# EAGLE design ECU_Board_2025 (EAGLE 9.6.2)

## Sheet 1 of 3
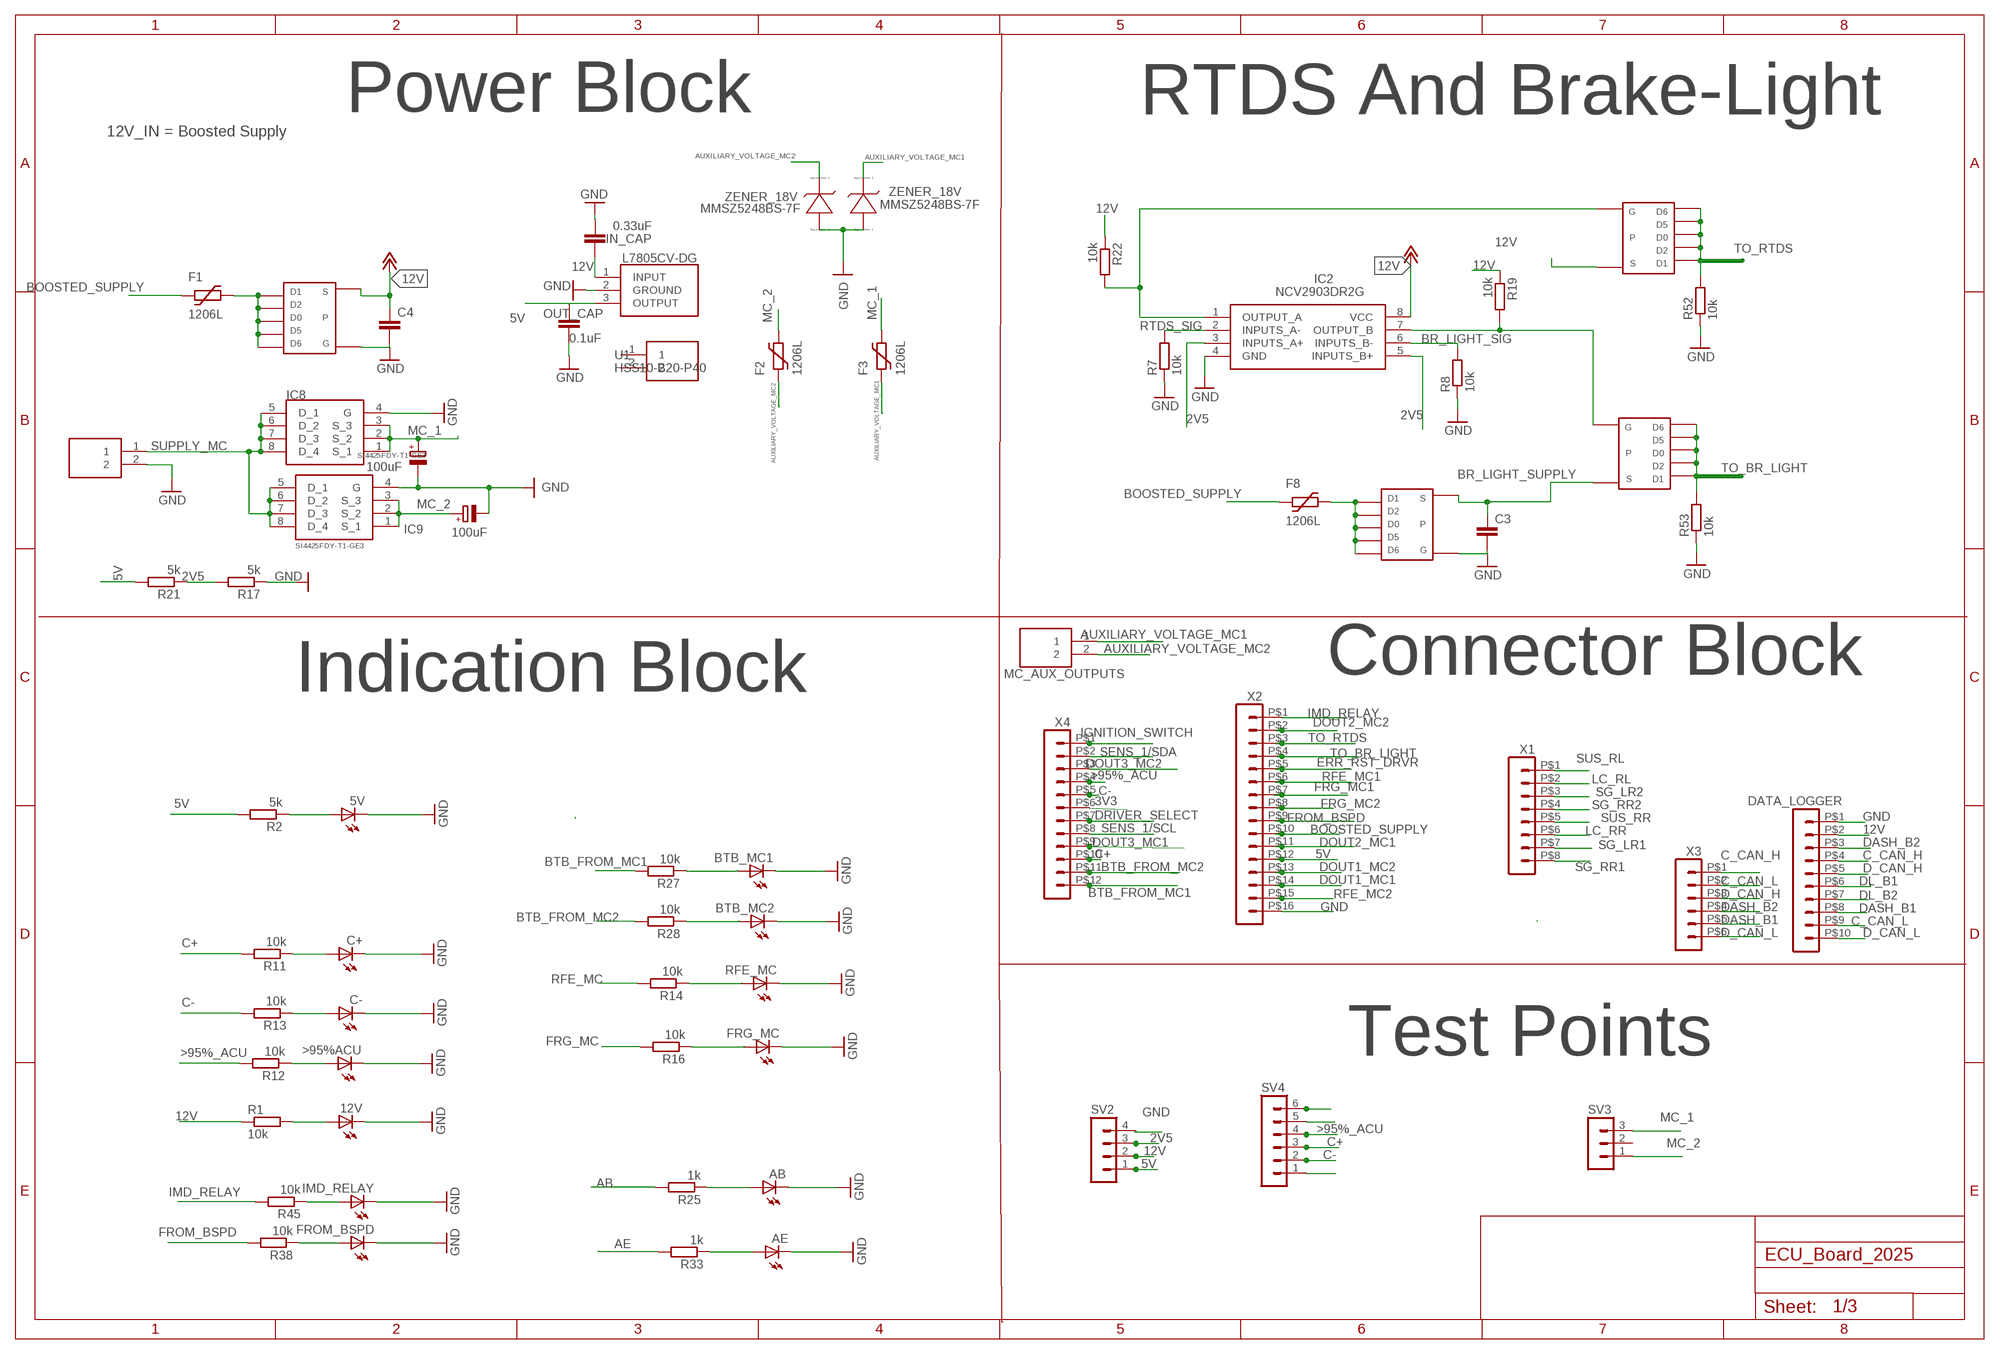
[diagram p0: schematic, sheet 1]

### Parts
5V  LED-FKIT-1206  [FKIT-LED-1206]
12V  LED-FKIT-1206  [FKIT-LED-1206]
>95%ACU  LED-FKIT-1206  [FKIT-LED-1206]
AB  LED-FKIT-1206  [FKIT-LED-1206]
AE  LED-FKIT-1206  [FKIT-LED-1206]
BOOSTED_SUPPLY1  172447-0002  [172447-YY02]
BTB_MC1  LED-FKIT-1206  [FKIT-LED-1206]
BTB_MC2  LED-FKIT-1206  [FKIT-LED-1206]
C3  C-EUC0805  [C0805]
C4  C-EUC0805  [C0805]
C7  100uF  CPOL-EUE2.5-6  [E2,5-6]
C8  100uF  CPOL-EUE2.5-6  [E2,5-6]
C+  LED-FKIT-1206  [FKIT-LED-1206]
C-  LED-FKIT-1206  [FKIT-LED-1206]
D4  ZENER  [SOD123]
D5  ZENER  [SOD123]
DATA_LOGGER  HEADER_POS10_43045-1012  [43045-1012]
F1  1206L  [1206L]
F2  1206L  [1206L]
F3  1206L  [1206L]
F8  1206L  [1206L]
FRG_MC  LED-FKIT-1206  [FKIT-LED-1206]
FROM_BSPD  LED-FKIT-1206  [FKIT-LED-1206]
IC2  NCV2903DR2G  [SOIC127P600X175-8N]
IC4  L7805CV-DG  [TO255P460X1020X2008-3P]
IC8  SI4425FDY-T1-GE3  [SOIC127P600X175-8N]
IC9  SI4425FDY-T1-GE3  [SOIC127P600X175-8N]
IMD_RELAY  LED-FKIT-1206  [FKIT-LED-1206]
IN_CAP  0.33uF  C-EUC0805  [C0805]
MC_AUX_OUTPUTS  172447-0002  [172447-YY02]
OUT_CAP  0.1uF  C-EUC0805  [C0805]
R1  10k  R-EU_R0805  [R0805]
R2  5k  R-EU_R0805  [R0805]
R7  10k  R-EU_R0805  [R0805]
R8  10k  R-EU_R0805  [R0805]
R11  10k  R-EU_R0805  [R0805]
R12  10k  R-EU_R0805  [R0805]
R13  10k  R-EU_R0805  [R0805]
R14  10k  R-EU_R0805  [R0805]
R16  10k  R-EU_R0805  [R0805]
R17  5k  R-EU_R0805  [R0805]
R19  10k  R-EU_R0805  [R0805]
R21  5k  R-EU_R0805  [R0805]
R22  10k  R-EU_R0805  [R0805]
R25  1k  R-EU_R0805  [R0805]
R27  10k  R-EU_R0805  [R0805]
R28  10k  R-EU_R0805  [R0805]
R33  1k  R-EU_R0805  [R0805]
R38  10k  R-EU_R0805  [R0805]
R45  10k  R-EU_R0805  [R0805]
R52  10k  R-EU_R0805  [R0805]
R53  10k  R-EU_R0805  [R0805]
RFE_MC  LED-FKIT-1206  [FKIT-LED-1206]
SV2  MA04-1  [MA04-1]
SV3  MA03-1  [MA03-1]
SV4  MA06-1  [MA06-1]
U1  HSS10-B20-P40  [HSS10B20P40]
U$1  TSOP-6_PMOS  [TSOP-6_PMOS]
U$13  TSOP-6_PMOS  [TSOP-6_PMOS]
U$16  TSOP-6_PMOS  [TSOP-6_PMOS]
U$17  TSOP-6_PMOS  [TSOP-6_PMOS]
X1  HEADER_POS8_44769-0801  [44769-0801]
X2  HEADER_POS16_44769-1601  [44769-1601]
X3  HEADER_POS6_43045-0612  [43045-0612]
X4  HEADER_POS12_44769-1201  [44769-1201]

### Nets
2V5: IC2.3(INPUTS_A+) IC2.5(INPUTS_B+) R17.2 R21.1 SV2.3 ; also sheet 2,3
3V3: SV4.1 X4.P$6 ; also sheet 2,3
5V: IC4.3(OUTPUT) OUT_CAP.1 R2.2 R21.2 SV2.1 X2.P$12 ; also sheet 2
12V: C4.1 DATA_LOGGER.P$2 IC2.8(VCC) IC4.1(INPUT) IN_CAP.1 R1.1 R19.1 R22.1 SV2.2 U$13.S U$16.S ; supply symbol labelled +12V ; also sheet 2,3
>95%_ACU: R12.2 SV4.4 X4.P$4 ; also sheet 2
AB: R25.2 ; also sheet 2
AE: R33.2 ; also sheet 2
AUXILIARY_VOLTAGE_MC1: D4.C(-) F3.P$1 MC_AUX_OUTPUTS.1
AUXILIARY_VOLTAGE_MC2: D5.C(-) F2.P$1 MC_AUX_OUTPUTS.2
BOOSTED_SUPPLY: F1.P$1 F8.P$1 X2.P$10
BR_LIGHT_SIG: IC2.6(INPUTS_B-) R8.2 ; also sheet 2
BR_LIGHT_SUPPLY: C3.1 U$1.S U$17.S
BTB_FROM_MC1: R27.2 X4.P$12 ; also sheet 2
BTB_FROM_MC2: R28.2 X4.P$11 ; also sheet 2
C+: R11.2 SV4.3 X4.P$10 ; also sheet 2
C-: R13.2 SV4.2 X4.P$5 ; also sheet 2
C_CAN_H: DATA_LOGGER.P$4 X3.P$1 ; also sheet 2
C_CAN_L: DATA_LOGGER.P$9 X3.P$2 ; also sheet 2
D_CAN_H: DATA_LOGGER.P$5 X3.P$3 ; also sheet 2
D_CAN_L: DATA_LOGGER.P$10 X3.P$6 ; also sheet 2
DASH_B1: DATA_LOGGER.P$8 X3.P$5
DASH_B2: DATA_LOGGER.P$3 X3.P$4
DL_B1: DATA_LOGGER.P$6 ; also sheet 2
DL_B2: DATA_LOGGER.P$7 ; also sheet 2
DOUT1_MC1: X2.P$14 ; also sheet 2
DOUT1_MC2: X2.P$13 ; also sheet 2
DOUT2_MC1: X2.P$11 ; also sheet 2
DOUT2_MC2: X2.P$2 ; also sheet 2
DOUT3_MC1: SV4.5 X4.P$9 ; also sheet 2
DOUT3_MC2: SV4.6 X4.P$3 ; also sheet 2
DRIVER_SELECT: X4.P$7 ; also sheet 2
ERR_RST_DRVR: X2.P$5 ; also sheet 3
FRG_MC: R16.2 ; also sheet 2
FRG_MC1: X2.P$7 ; also sheet 2
FRG_MC2: X2.P$8 ; also sheet 2
FROM_BSPD: R38.2 X2.P$9 ; also sheet 3
GND: 5V.C 12V.C >95%ACU.C AB.C AE.C BOOSTED_SUPPLY1.2 BTB_MC1.C BTB_MC2.C C3.2 C4.2 C7.- C8.- C+.C C-.C D4.A(+) D5.A(+) DATA_LOGGER.P$1 FRG_MC.C FROM_BSPD.C IC2.4(GND) IC4.2(GROUND) IC8.4(G) IC9.4(G) IMD_RELAY.C IN_CAP.2 OUT_CAP.2 R7.1 R8.1 R17.1 R52.1 R53.1 RFE_MC.C SV2.4 U$1.G U$13.G X2.P$16 ; also sheet 2,3
IGNITION_SWITCH: X4.P$1 ; also sheet 2
IMD_RELAY: R45.2 X2.P$1 ; also sheet 3
LC_RL: X1.P$2 ; also sheet 2
LC_RR: X1.P$6 ; also sheet 2
MC_1: C7.+ F3.P$2 IC8.1(S_1) IC8.2(S_2) IC8.3(S_3) SV3.3
MC_2: C8.+ F2.P$2 IC9.1(S_1) IC9.2(S_2) IC9.3(S_3) SV3.1
N$1: 12V.A R1.2
N$2: R14.1 RFE_MC.A
N$3: AB.A R25.1
N$4: FRG_MC.A R16.1
N$5: IC2.1(OUTPUT_A) R22.2 U$16.G
N$6: 5V.A R2.1
N$7: IC2.7(OUTPUT_B) R19.2 U$17.G
N$8: AE.A R33.1
N$10: F8.P$2 U$1.1 U$1.2 U$1.5 U$1.6 U$1.D(D0)
N$15: C+.A R11.1
N$16: >95%ACU.A R12.1
N$17: C-.A R13.1
N$18: BTB_MC1.A R27.1
N$22: IMD_RELAY.A R45.1
N$26: FROM_BSPD.A R38.1
N$31: BTB_MC2.A R28.1
N$46: F1.P$2 U$13.1 U$13.2 U$13.5 U$13.6 U$13.D(D0)
RFE_MC: R14.2 ; also sheet 2
RFE_MC1: X2.P$6 ; also sheet 2
RFE_MC2: X2.P$15 ; also sheet 2
RTDS_SIG: IC2.2(INPUTS_A-) R7.2 ; also sheet 2
SENS_1/SCL: X4.P$8 ; also sheet 3
SENS_1/SDA: X4.P$2 ; also sheet 3
SG_LR1: X1.P$7 ; also sheet 2
SG_LR2: X1.P$3 ; also sheet 2
SG_RR1: X1.P$8 ; also sheet 2
SG_RR2: X1.P$4 ; also sheet 2
SUPPLY_MC: BOOSTED_SUPPLY1.1 IC8.5(D_1) IC8.6(D_2) IC8.7(D_3) IC8.8(D_4) IC9.5(D_1) IC9.6(D_2) IC9.7(D_3) IC9.8(D_4)
SUS_RL: X1.P$1 ; also sheet 2
SUS_RR: X1.P$5 ; also sheet 2
TO_BR_LIGHT: R53.2 U$17.1 U$17.2 U$17.5 U$17.6 U$17.D(D0) X2.P$4
TO_RTDS: R52.2 U$16.1 U$16.2 U$16.5 U$16.6 U$16.D(D0) X2.P$3
Unconnected: SV3.2 U1.1 U1.2

### Notes on the sheet
- Power Block | RTDS And Brake-Light
- 12V_IN = Boosted Supply
- Indication Block | Connector Block
- Test Points

## Sheet 2 of 3
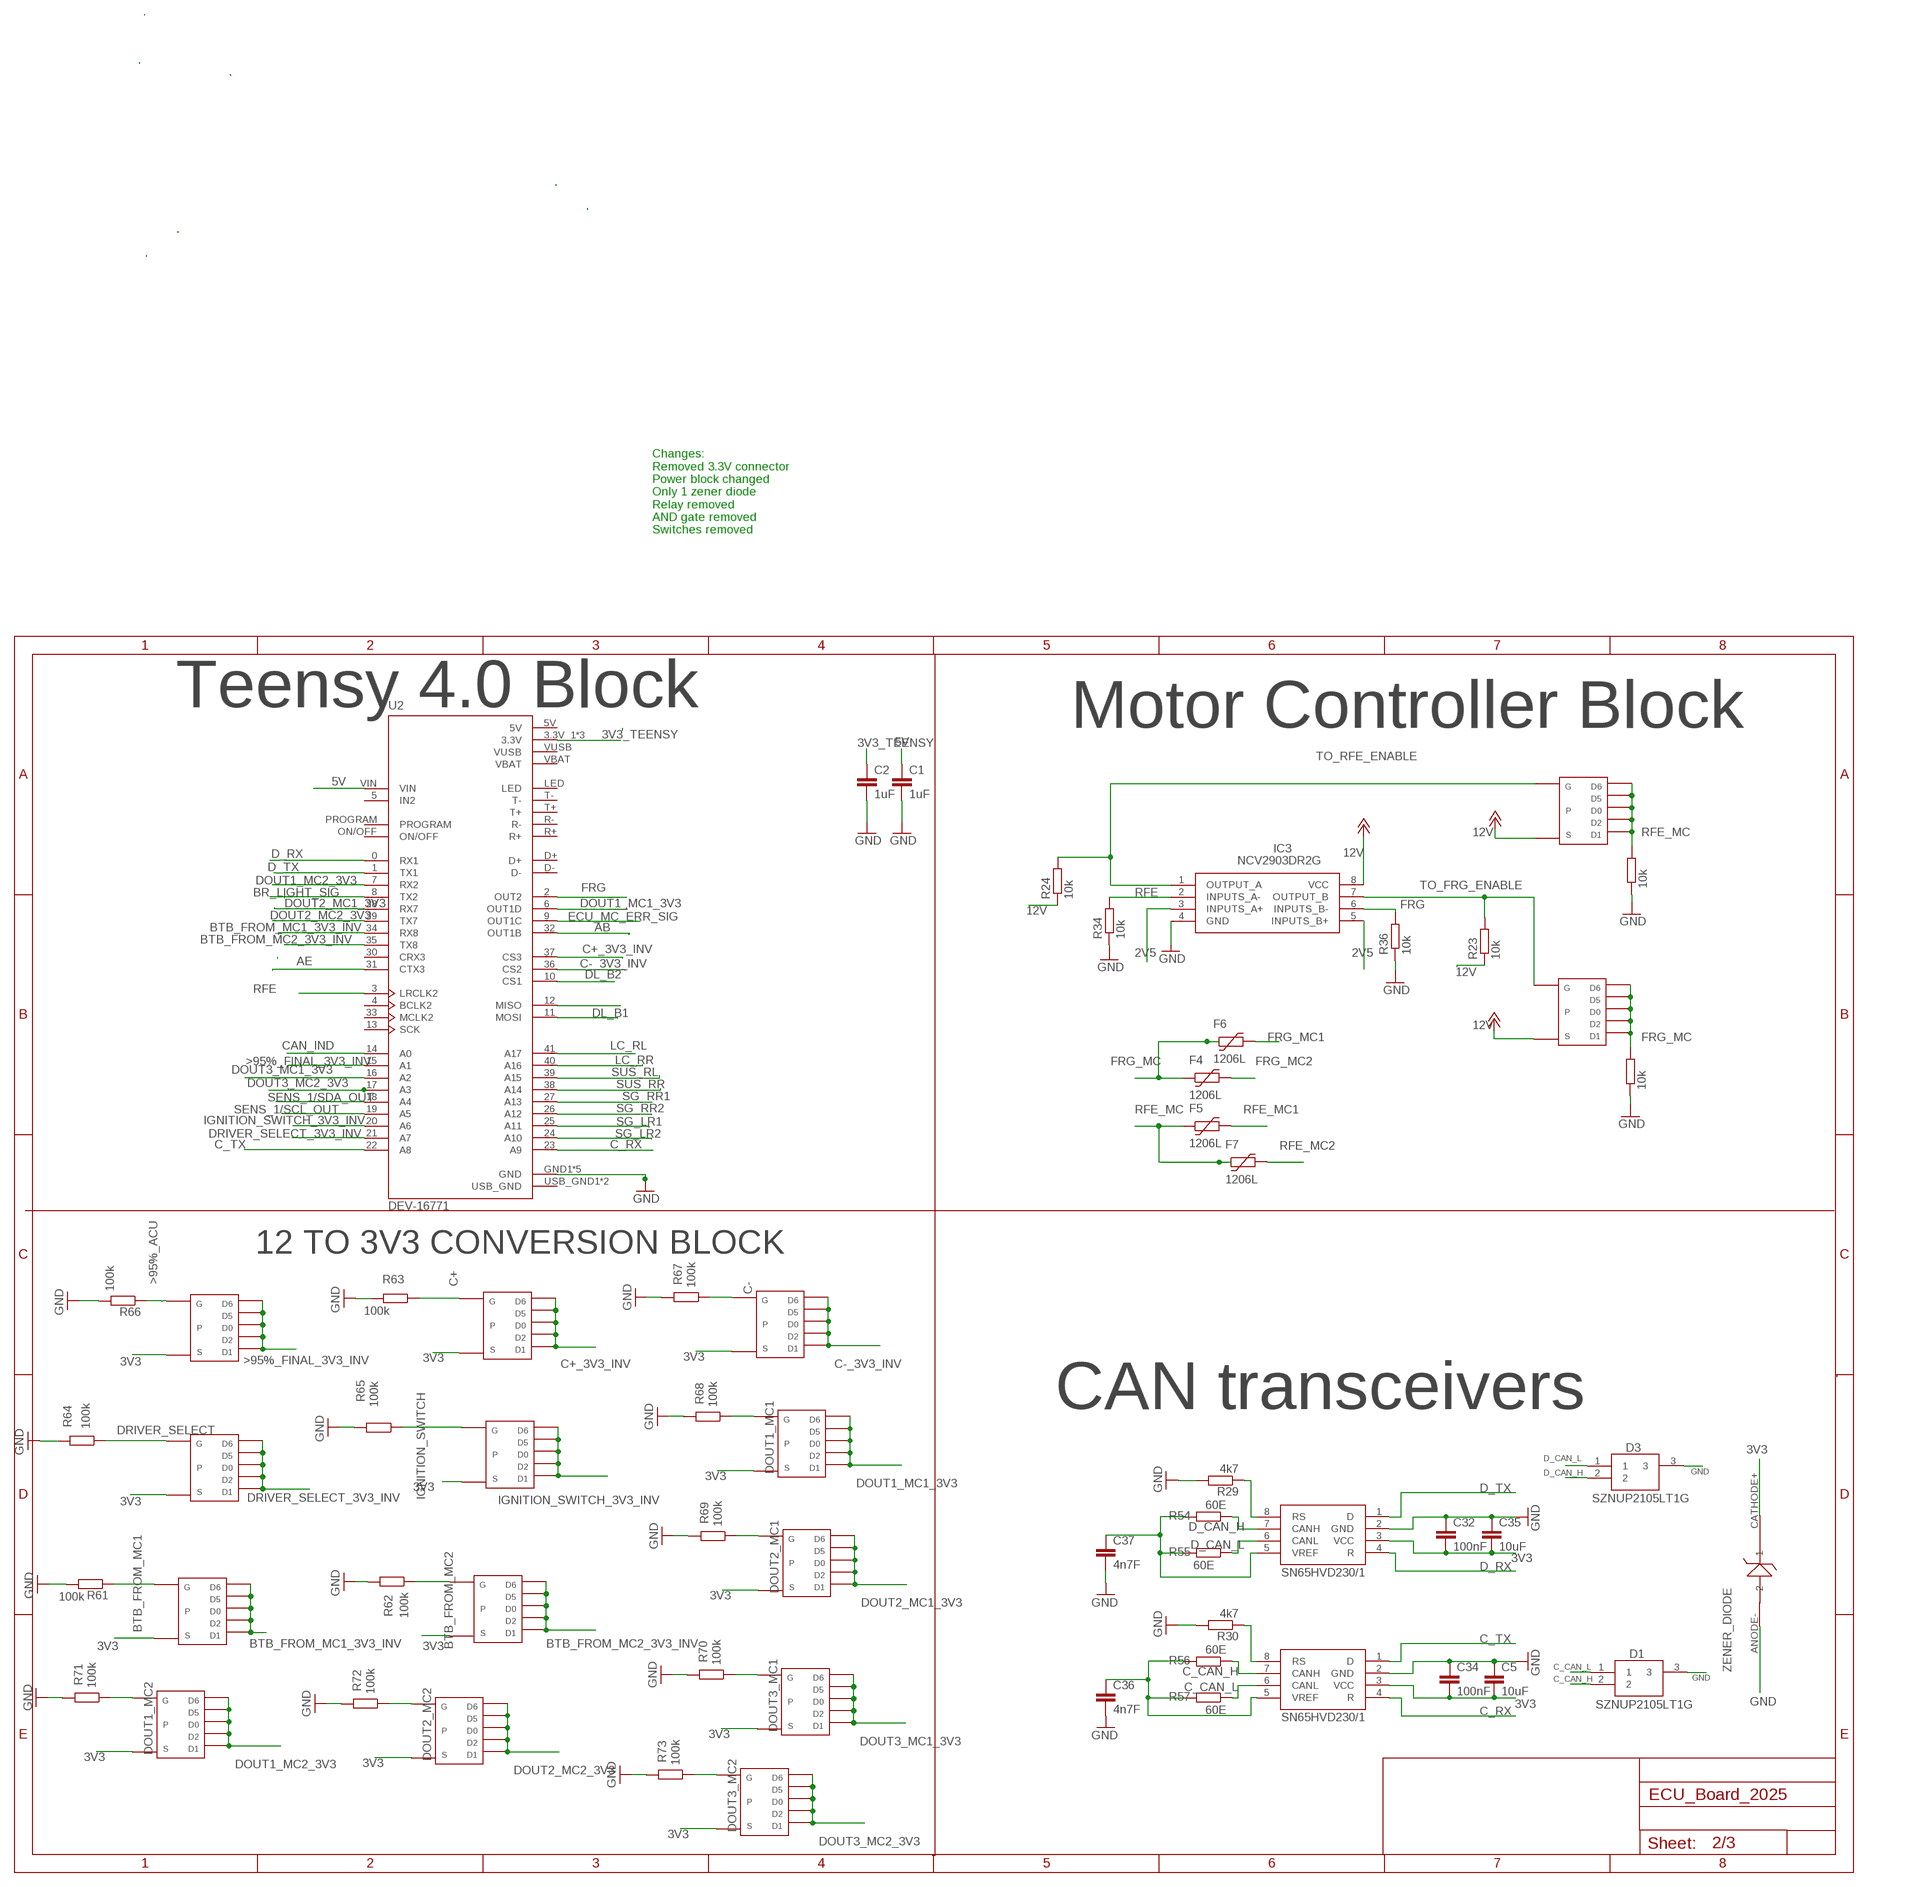
[diagram p1: schematic, sheet 2]

### Parts
C1  1uF  C-EUC0805  [C0805]
C2  1uF  C-EUC0805  [C0805]
C5  10uF  C-EUC0805  [C0805]
C32  100nF  C-EUC0805  [C0805]
C34  100nF  C-EUC0805  [C0805]
C35  10uF  C-EUC0805  [C0805]
C36  4n7F  C-EUC0805  [C0805]
C37  4n7F  C-EUC0805  [C0805]
D1  SZNUP2105LT1G  [SOT96P237X111-3N]
D3  SZNUP2105LT1G  [SOT96P237X111-3N]
F4  1206L  [1206L]
F5  1206L  [1206L]
F6  1206L  [1206L]
F7  1206L  [1206L]
IC3  NCV2903DR2G  [SOIC127P600X175-8N]
R23  10k  R-EU_R0805  [R0805]
R24  10k  R-EU_R0805  [R0805]
R29  4k7  R-EU_R0805  [R0805]
R30  4k7  R-EU_R0805  [R0805]
R31  10k  R-EU_R0805  [R0805]
R32  10k  R-EU_R0805  [R0805]
R34  10k  R-EU_R0805  [R0805]
R36  10k  R-EU_R0805  [R0805]
R54  60E  R-EU_R0805  [R0805]
R55  60E  R-EU_R0805  [R0805]
R56  60E  R-EU_R0805  [R0805]
R57  60E  R-EU_R0805  [R0805]
R61  100k  R-EU_R0805  [R0805]
R62  100k  R-EU_R0805  [R0805]
R63  100k  R-EU_R0805  [R0805]
R64  100k  R-EU_R0805  [R0805]
R65  100k  R-EU_R0805  [R0805]
R66  100k  R-EU_R0805  [R0805]
R67  100k  R-EU_R0805  [R0805]
R68  100k  R-EU_R0805  [R0805]
R69  100k  R-EU_R0805  [R0805]
R70  100k  R-EU_R0805  [R0805]
R71  100k  R-EU_R0805  [R0805]
R72  100k  R-EU_R0805  [R0805]
R73  100k  R-EU_R0805  [R0805]
U2  DEV-16771  [MODULE_DEV-16771]
U$7  SN65HVD230/1  [SO8]
U$8  SN65HVD230/1  [SO8]
U$14  TSOP-6_PMOS  [TSOP-6_PMOS]
U$15  TSOP-6_PMOS  [TSOP-6_PMOS]
U$20  ZENER_DIODE  [SOD323HE]
U$24  TSOP-6_PMOS  [TSOP-6_PMOS]
U$25  TSOP-6_PMOS  [TSOP-6_PMOS]
U$26  TSOP-6_PMOS  [TSOP-6_PMOS]
U$27  TSOP-6_PMOS  [TSOP-6_PMOS]
U$28  TSOP-6_PMOS  [TSOP-6_PMOS]
U$29  TSOP-6_PMOS  [TSOP-6_PMOS]
U$30  TSOP-6_PMOS  [TSOP-6_PMOS]
U$31  TSOP-6_PMOS  [TSOP-6_PMOS]
U$32  TSOP-6_PMOS  [TSOP-6_PMOS]
U$33  TSOP-6_PMOS  [TSOP-6_PMOS]
U$34  TSOP-6_PMOS  [TSOP-6_PMOS]
U$35  TSOP-6_PMOS  [TSOP-6_PMOS]
U$36  TSOP-6_PMOS  [TSOP-6_PMOS]

### Nets
2V5: IC3.3(INPUTS_A+) IC3.5(INPUTS_B+) ; also sheet 1,3
3V3: C5.2 C32.2 C34.2 C35.2 U$7.3(VCC) U$8.3(VCC) U$20.CATHODE+ U$24.S U$25.S U$26.S U$27.S U$28.S U$29.S U$30.S U$31.S U$32.S U$33.S U$34.S U$35.S U$36.S ; also sheet 1,3
3V3_TEENSY: C2.1 U2.3.3V_1(3.3V) U2.3.3V_2(3.3V) U2.3.3V_3(3.3V) ; also sheet 3
5V: C1.1 U2.VIN ; also sheet 1
12V: IC3.8(VCC) R23.1 R24.1 U$14.S U$15.S ; supply symbol labelled +12V ; also sheet 1,3
>95%_ACU: R66.1 U$25.G ; also sheet 1
>95%_FINAL_3V3_INV: U2.15(A1) U$25.1 U$25.2 U$25.5 U$25.6 U$25.D(D0)
AB: U2.32(OUT1B) ; also sheet 1
AE: U2.31(CTX3) ; also sheet 1
BR_LIGHT_SIG: U2.8(TX2) ; also sheet 1
BTB_FROM_MC1: R61.1 U$27.G ; also sheet 1
BTB_FROM_MC1_3V3_INV: U2.34(RX8) U$27.1 U$27.2 U$27.5 U$27.6 U$27.D(D0)
BTB_FROM_MC2: R62.1 U$26.G ; also sheet 1
BTB_FROM_MC2_3V3_INV: U2.35(TX8) U$26.1 U$26.2 U$26.5 U$26.6 U$26.D(D0)
C+: R63.1 U$24.G ; also sheet 1
C+_3V3_INV: U2.37(CS3) U$24.1 U$24.2 U$24.5 U$24.6 U$24.D(D0)
C-: R67.1 U$30.G ; also sheet 1
C-_3V3_INV: U2.36(CS2) U$30.1 U$30.2 U$30.5 U$30.6 U$30.D(D0)
C_CAN_H: D1.2 R56.1 U$7.7(CANH) ; also sheet 1
C_CAN_L: D1.1 R57.1 U$7.6(CANL) ; also sheet 1
C_RX: U2.23(A9) U$7.4(R)
C_TX: U2.22(A8) U$7.1(D)
CAN_IND: U2.14(A0)
D_CAN_H: D3.2 R54.1 U$8.7(CANH) ; also sheet 1
D_CAN_L: D3.1 R55.1 U$8.6(CANL) ; also sheet 1
D_RX: U2.0(RX1) U$8.4(R)
D_TX: U2.1(TX1) U$8.1(D)
DL_B1: U2.11(MOSI) ; also sheet 1
DL_B2: U2.10(CS1) ; also sheet 1
DOUT1_MC1: R68.1 U$31.G ; also sheet 1
DOUT1_MC1_3V3: U2.6(OUT1D) U$31.1 U$31.2 U$31.5 U$31.6 U$31.D(D0)
DOUT1_MC2: R71.1 U$34.G ; also sheet 1
DOUT1_MC2_3V3: U2.7(RX2) U$34.1 U$34.2 U$34.5 U$34.6 U$34.D(D0)
DOUT2_MC1: R69.1 U$32.G ; also sheet 1
DOUT2_MC1_3V3: U2.28(RX7) U$32.1 U$32.2 U$32.5 U$32.6 U$32.D(D0)
DOUT2_MC2: R72.1 U$35.G ; also sheet 1
DOUT2_MC2_3V3: U2.29(TX7) U$35.1 U$35.2 U$35.5 U$35.6 U$35.D(D0)
DOUT3_MC1: R70.1 U$33.G ; also sheet 1
DOUT3_MC1_3V3: U2.16(A2) U$33.1 U$33.2 U$33.5 U$33.6 U$33.D(D0)
DOUT3_MC2: R73.1 U$36.G ; also sheet 1
DOUT3_MC2_3V3: U2.17(A3) U$36.1 U$36.2 U$36.5 U$36.6 U$36.D(D0)
DRIVER_SELECT: R64.1 U$29.G ; also sheet 1
DRIVER_SELECT_3V3_INV: U2.21(A7) U$29.1 U$29.2 U$29.5 U$29.6 U$29.D(D0)
ECU_MC_ERR_SIG: U2.9(OUT1C) ; also sheet 3
FRG: IC3.6(INPUTS_B-) R36.2 U2.2(OUT2)
FRG_MC: F4.P$1 F6.P$1 R32.2 U$15.1 U$15.2 U$15.5 U$15.6 U$15.D(D0) ; also sheet 1
FRG_MC1: F6.P$2 ; also sheet 1
FRG_MC2: F4.P$2 ; also sheet 1
GND: C1.2 C2.2 C5.1 C32.1 C34.1 C35.1 C36.2 C37.2 D1.3 D3.3 IC3.4(GND) R29.2 R30.2 R31.1 R32.1 R34.1 R36.1 R61.2 R62.2 R63.2 R64.2 R65.2 R66.2 R67.2 R68.2 R69.2 R70.2 R71.2 R72.2 R73.2 U2.GND1(GND) U2.GND2(GND) U2.GND3(GND) U2.GND4(GND) U2.GND5(GND) U$7.2(GND) U$8.2(GND) U$20.ANODE- ; also sheet 1,3
IGNITION_SWITCH: R65.1 U$28.G ; also sheet 1
IGNITION_SWITCH_3V3_INV: U2.20(A6) U$28.1 U$28.2 U$28.5 U$28.6 U$28.D(D0)
LC_RL: U2.41(A17) ; also sheet 1
LC_RR: U2.40(A16) ; also sheet 1
N$32: R29.1 U$8.8(RS)
N$33: C37.1 R54.2 R55.2 U$8.5(VREF)
N$35: C36.1 R56.2 R57.2 U$7.5(VREF)
N$37: R30.1 U$7.8(RS)
RFE: IC3.2(INPUTS_A-) R34.2 U2.3(LRCLK2)
RFE_MC: F5.P$1 F7.P$1 R31.2 U$14.1 U$14.2 U$14.5 U$14.6 U$14.D(D0) ; also sheet 1
RFE_MC1: F5.P$2 ; also sheet 1
RFE_MC2: F7.P$2 ; also sheet 1
RTDS_SIG: U2.12(MISO) ; also sheet 1
SENS_1/SCL_OUT: U2.19(A5) ; also sheet 3
SENS_1/SDA_OUT: U2.18(A4) ; also sheet 3
SG_LR1: U2.25(A11) ; also sheet 1
SG_LR2: U2.24(A10) ; also sheet 1
SG_RR1: U2.27(A13) ; also sheet 1
SG_RR2: U2.26(A12) ; also sheet 1
SUS_RL: U2.39(A15) ; also sheet 1
SUS_RR: U2.38(A14) ; also sheet 1
TO_FRG_ENABLE: IC3.7(OUTPUT_B) R23.2 U$15.G
TO_RFE_ENABLE: IC3.1(OUTPUT_A) R24.2 U$14.G
Unconnected: U2.4(BCLK2) U2.5(IN2) U2.13(SCK) U2.30(CRX3) U2.33(MCLK2) U2.D+ U2.D- U2.LED U2.ON/OFF U2.PROGRAM U2.R+ U2.R- U2.T+ U2.T- U2.VBAT U2.VUSB

### Notes on the sheet
- Changes:
  Removed 3.3V connector
  Power block changed
  Only 1 zener diode
  Relay removed
  AND gate removed
  Switches removed
- Teensy 4.0 Block
- Motor Controller Block
- 12 TO 3V3 CONVERSION BLOCK
- CAN transceivers

## Sheet 3 of 3
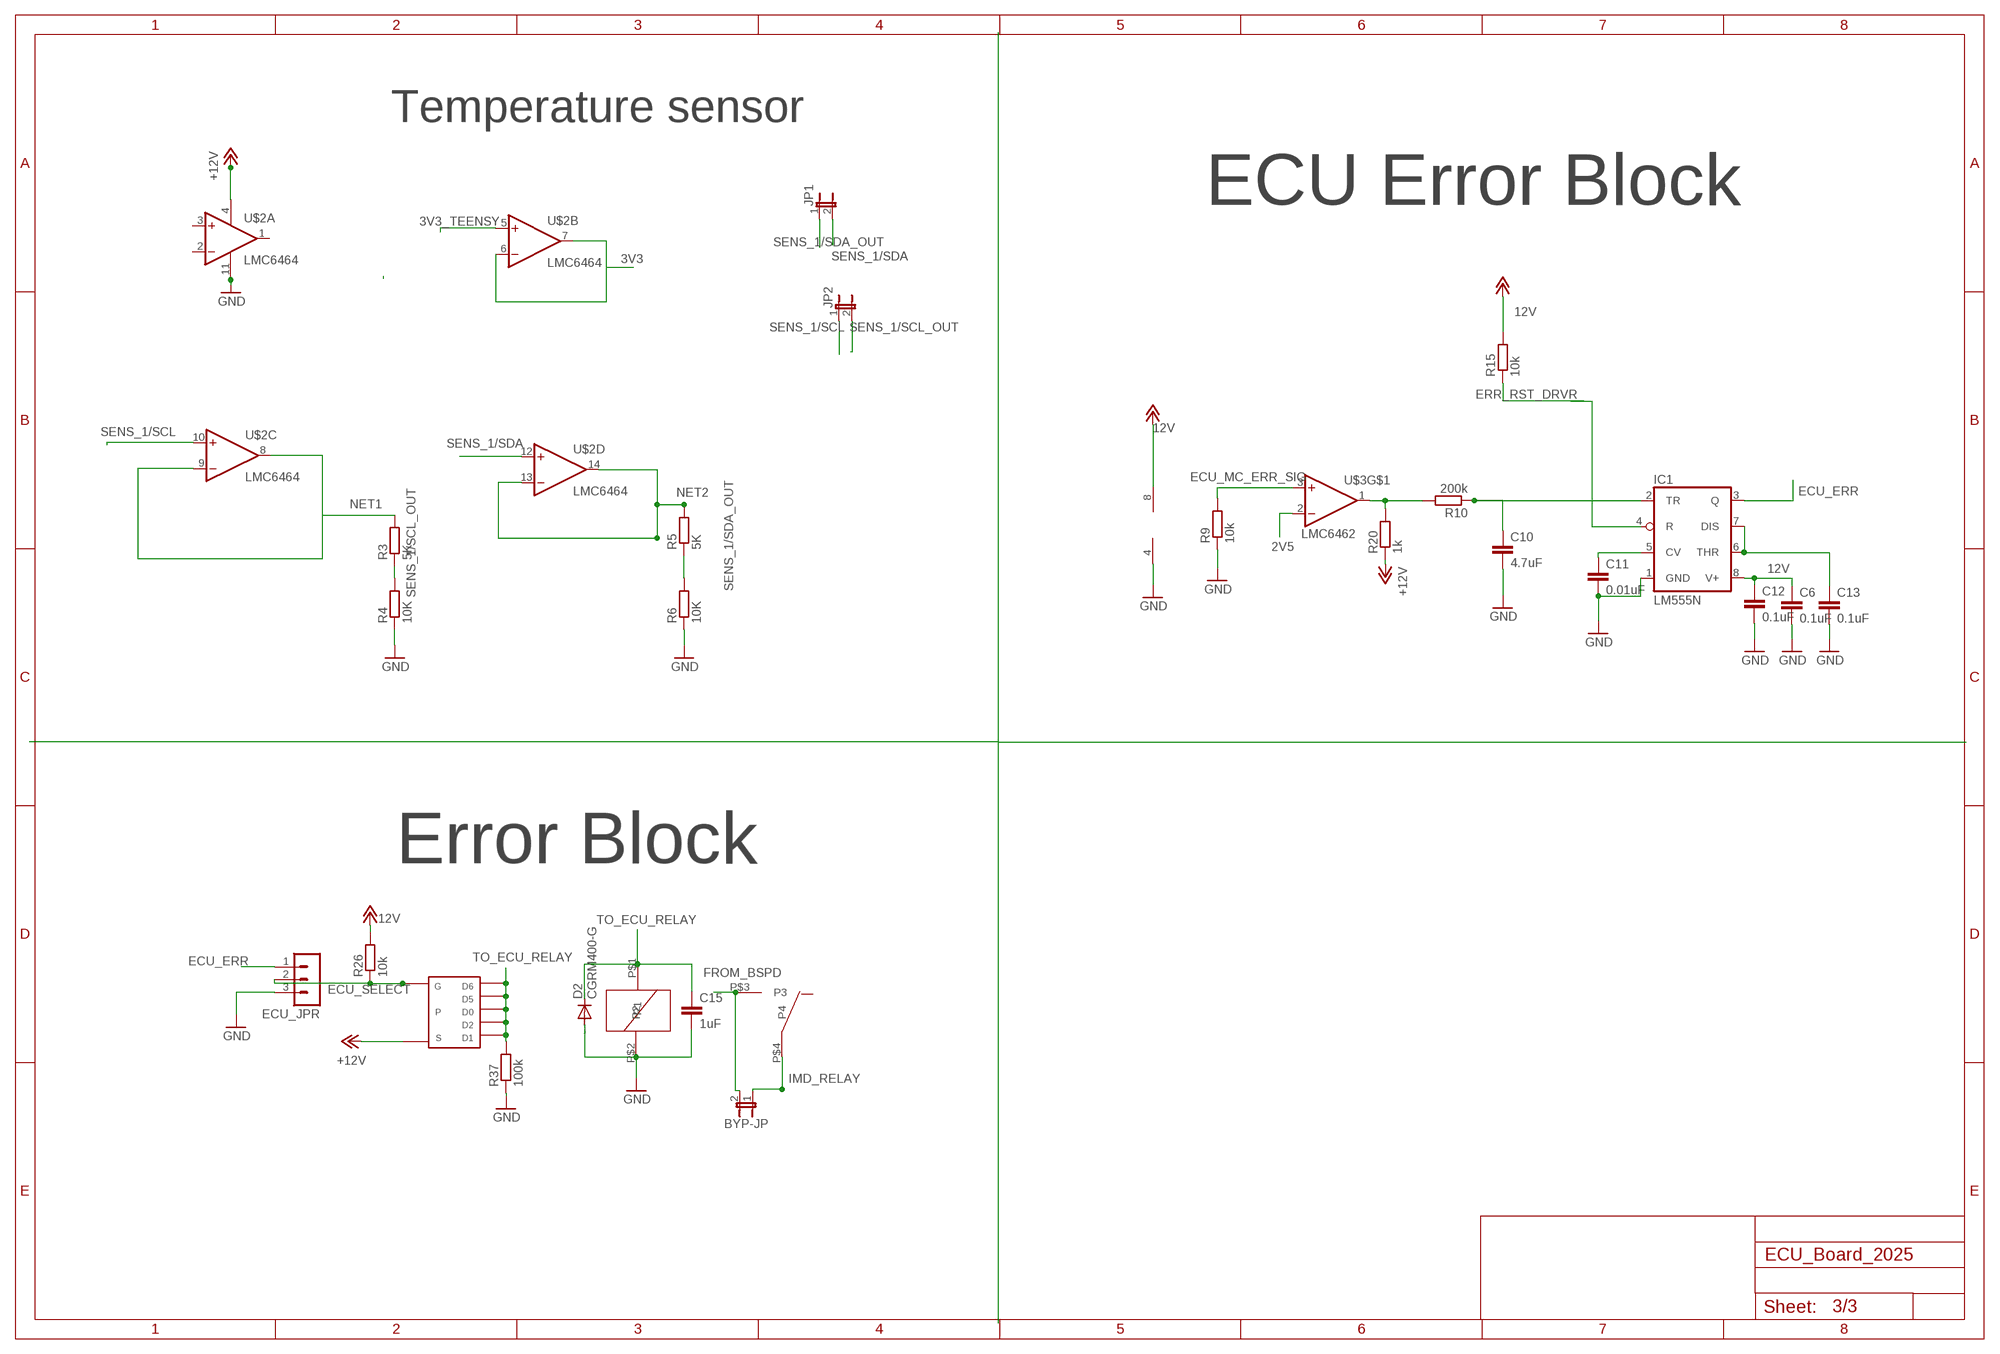
[diagram p2: schematic, sheet 3]

### Parts
BYP-JP  JP1E  [JP1]
C6  0.1uF  C-EUC0805  [C0805]
C10  4.7uF  C-EUC0805  [C0805]
C11  0.01uF  C-EUC0805  [C0805]
C12  0.1uF  C-EUC0805  [C0805]
C13  0.1uF  C-EUC0805  [C0805]
C15  1uF  C-EUC0805  [C0805]
D2  CGRM400-G  [SOD-123_MINI-SMA]
ECU_JPR  MA03-1  [MA03-1]
IC1  LM555N  [DIL08]
JP1  JP1E  [JP1]
JP2  JP1E  [JP1]
R3  5K  R-EU_R0805  [R0805]
R4  10K  R-EU_R0805  [R0805]
R5  5K  R-EU_R0805  [R0805]
R6  10K  R-EU_R0805  [R0805]
R9  10k  R-EU_R0805  [R0805]
R10  200k  R-EU_R0805  [R0805]
R15  10k  R-EU_R0805  [R0805]
R20  1k  R-EU_R0805  [R0805]
R26  10k  R-EU_R0805  [R0805]
R37  100k  R-EU_R0805  [R0805]
U$2  LMC6464  [SO14_LONGPADS]
U$3  LMC6462  [S08]
U$9  G6DN_RELAY  [G6DN_RELAY]
U$10  TSOP-6_PMOS  [TSOP-6_PMOS]

### Nets
2V5: U$3.2(-IN) ; also sheet 1,2
3V3: U$2.6(B:-IN) U$2.7(B:OUT) ; also sheet 1,2
3V3_TEENSY: U$2.5(B:+IN) ; also sheet 2
12V: C6.1 C12.1 IC1.8(V+) R15.2 R20.1 R26.2 U$2.4(POW:V+) U$3.8(V+) U$10.S ; supply symbol labelled +12V ; also sheet 1,2
ECU_ERR: ECU_JPR.1 IC1.3(Q)
ECU_MC_ERR_SIG: R9.2 U$3.3(+IN) ; also sheet 2
ECU_SELECT: ECU_JPR.2 R26.1 U$10.G
ERR_RST_DRVR: R15.1 ; also sheet 1
FROM_BSPD: BYP-JP.2 U$9.P$3(P3) ; also sheet 1
GND: C6.2 C10.2 C11.2 C12.2 C13.2 C15.2 D2.A ECU_JPR.3 IC1.1(GND) R4.1 R6.1 R9.1 R37.1 U$2.11(POW:V-) U$3.4(V-) U$9.P$2(P2) ; also sheet 1,2
IMD_RELAY: BYP-JP.1 U$9.P$4(P4) ; also sheet 1
N$12: C10.1 IC1.2(TR) R10.1
N$13: C11.1 IC1.5(CV)
N$14: R10.2 R20.2 U$3.1(OUT)
N$19: C13.1 IC1.6(THR) IC1.7(DIS)
N$20: IC1.4(R)
NET1: R3.2 U$2.8(C:OUT) U$2.9(C:-IN)
NET2: R5.2 U$2.13(D:-IN) U$2.14(D:OUT)
SENS_1/SCL: JP2.1 U$2.10(C:+IN) ; also sheet 1
SENS_1/SCL_OUT: JP2.2 R3.1 R4.2 ; also sheet 2
SENS_1/SDA: JP1.2 U$2.12(D:+IN) ; also sheet 1
SENS_1/SDA_OUT: JP1.1 R5.1 R6.2 ; also sheet 2
TO_ECU_RELAY: C15.1 D2.C R37.2 U$9.P$1(P1) U$10.1 U$10.2 U$10.5 U$10.6 U$10.D(D0)
Unconnected: U$2.1(A:OUT) U$2.2(A:-IN) U$2.3(A:+IN) U$3.5(+IN) U$3.6(-IN) U$3.7(OUT)

### Notes on the sheet
- Temperature sensor
- ECU Error Block
- Error Block

## Power pins joined to a net without a drawn wire
5V: U2.5V
USB_GND: U2.USB_GND1(USB_GND) U2.USB_GND2(USB_GND)

## Library data of the parts
5V 12V >95%ACU AB AE BTB_MC1 BTB_MC2 C+ C- FRG_MC FROM_BSPD IMD_RELAY RFE_MC = IIT_BOMBAY_Racing:LED: LEDs Standard schematic elements and footprints for 5mm, 3mm, 1206, and 0603 sized LEDs. 5mm - Spark Fun Electronics SKU : COM-00529 (and others)
BOOSTED_SUPPLY1 MC_AUX_OUTPUTS = 172447-0002:172447-0002: Mini-Fit Jr. Header, Dual Row, Vertical, with Snap-in Plastic Peg PCB Lock, 2 Circuits, Nylon 6/6, UL 94V-2, Glow-Wire Capable Source: Datasheet <https://www.molex.com/pdm_docs/sd/1724470002_sd.pdf>; DESCRIPTION: Mini-Fit Jr. Header, Dual Row, Vertical, with Snap-in Plastic Peg PCB Lock, 2 Circuits, Nylon 6/6, UL 94V-2, Glow-Wire Capable; HEIGHT: 12.8mm; MANUFACTURER_NAME: Molex; MANUFACTURER_PART_NUMBER: 172447-0002; MOUSER_PART_NUMBER: 538-172447-0002; MOUSER_PRICE-STOCK: https://www.mouser.co.uk/ProductDetail/Molex/172447-0002?qs=%2FstZWcIQ8mj0J1Oi8cYlzQ%3D%3D
BYP-JP JP1 JP2 = jumper:JP1E: JUMPER
C1-C6 C10-C13 C15 C32 C34-C37 IN_CAP OUT_CAP = IIT_BOMBAY_Racing:C-EU: CAPACITOR, European symbol
C7 C8 = IIT_BOMBAY_Racing:CPOL-EU: POLARIZED CAPACITOR, European symbol
D1 D3 = SamacSys_Parts:SZNUP2105LT1G: Dual Bi-Directional TVS Diode, 350W peak, 3-pin SOT-23 Source: Datasheet <http://www.onsemi.com/pub/Collateral/NUP2105L-D.PDF>; DESCRIPTION: Dual Bi-Directional TVS Diode, 350W peak, 3-pin SOT-23; HEIGHT: 1.11mm; MANUFACTURER_NAME: ON Semiconductor; MANUFACTURER_PART_NUMBER: SZNUP2105LT1G; MOUSER_PART_NUMBER: 863-SZNUP2105LT1G; MOUSER_PRICE-STOCK: https://www.mouser.co.uk/ProductDetail/ON-Semiconductor/SZNUP2105LT1G?qs=PJJcWtbOkNWqqZbXH80dfQ%3D%3D
D2 = IIT_BOMBAY_Racing:CGRM400*-G: Molded plasitc,JEDEC SOD-123/Mini SMA Source: Comchip CGRM4001-G.pdf
D4 D5 = sym:ZENER: Zener Diode
DATA_LOGGER = IIT_BOMBAY_Racing2:HEADER_POS10_?: Molex - Micro-Fit 3.0 Series connector, 3.00mm (0.118") pitch header, 10 positions.
ECU_JPR SV3 = con-lstb:MA03-1: PIN HEADER; OC_FARNELL: unknown; OC_NEWARK: unknown
F1-F8 = IIT_BOMBAY_Racing:1206L
IC1 = linear:*555: TIMER
IC2 IC3 = comparators:NCV2903DR2G: ON Semiconductor NCV2903DR2G Dual Comparator, CMOS/TTL O/P, 1.5us 2 36 V dc 8-Pin SOIC Source: Datasheet <http://www.onsemi.com/pub/Collateral/LM393-D.PDF>; DESCRIPTION: ON Semiconductor NCV2903DR2G Dual Comparator, CMOS/TTL O/P, 1.5us 2 36 V dc 8-Pin SOIC; HEIGHT: 1.75mm; MANUFACTURER_NAME: onsemi; MANUFACTURER_PART_NUMBER: NCV2903DR2G; MOUSER_PART_NUMBER: 863-NCV2903DR2G; MOUSER_PRICE-STOCK: https://www.mouser.co.uk/ProductDetail/onsemi/NCV2903DR2G?qs=8sOby8ZxZLHCHCHBLVGsJQ%3D%3D
IC4 = SamacSys_Parts:L7805CV-DG: Voltage Regulator 5V 4% 1.5A TO220 L7805CV-DG, Linear Voltage Regulator, Current Limit, Shut-Down 1.5A 5 V, 3-Pin TO220 Source: Datasheet <http://www.st.com/web/en/resource/technical/document/datasheet/CD00000444.pdf>; DESCRIPTION: Voltage Regulator 5V 4% 1.5A TO220 L7805CV-DG, Linear Voltage Regulator, Current Limit, Shut-Down 1.5A 5 V, 3-Pin TO220; HEIGHT: 4.6mm; MANUFACTURER_NAME: STMicroelectronics; MANUFACTURER_PART_NUMBER: L7805CV-DG; MOUSER_PART_NUMBER: 511-L7805CV-DG; MOUSER_PRICE-STOCK: https://www.mouser.co.uk/ProductDetail/STMicroelectronics/L7805CV-DG?qs=T%2FOtf55vL7c3O0as9P9fAw%3D%3D
IC8 IC9 = SamacSys_Parts:SI4425FDY-T1-GE3: MOSFET P-CHANNEL 30-V (D-S) MOSFET Source: Datasheet <https://www.vishay.com/docs/77095/si4425fdy.pdf>; DESCRIPTION: MOSFET P-CHANNEL 30-V (D-S) MOSFET; HEIGHT: 1.75mm; MANUFACTURER_NAME: Vishay; MANUFACTURER_PART_NUMBER: SI4425FDY-T1-GE3; MOUSER_PART_NUMBER: 78-SI4425FDY-T1-GE3; MOUSER_PRICE-STOCK: https://www.mouser.co.uk/ProductDetail/Vishay-Siliconix/SI4425FDY-T1-GE3?qs=%252B6g0mu59x7IUQKSn86z1oQ%3D%3D
R1 R17 R21 = rcl:R-EU_: RESISTOR, European symbol; SPICEPREFIX: R
R2-R16 R19 R20 R22-R34 R36-R38 R45 R52-R57 R61-R73 = IIT_BOMBAY_Racing:R-EU_: RESISTOR, European symbol
SV2 = con-lstb:MA04-1: PIN HEADER; OC_FARNELL: unknown; OC_NEWARK: unknown
SV4 = con-lstb:MA06-1: PIN HEADER; OC_FARNELL: unknown; OC_NEWARK: unknown
U1 = SamacSys_Parts:HSS10-B20-P40: Heat Sinks heat sink, stamping, TO-220, 29.97 x 25. Source: Datasheet <https://www.cuidevices.com/product/resource/hss10-b20-p40.pdf>; DESCRIPTION: Heat Sinks heat sink, stamping, TO-220, 29.97 x 25.; HEIGHT: 29.97mm; MANUFACTURER_NAME: CUI Inc.; MANUFACTURER_PART_NUMBER: HSS10-B20-P40; MOUSER_PART_NUMBER: 490-HSS10-B20-P40; MOUSER_PRICE-STOCK: https://www.mouser.co.uk/ProductDetail/CUI-Devices/HSS10-B20-P40?qs=QNEnbhJQKvYYvwy4FCjq1A%3D%3D
U2 = DEV-16771:DEV-16771: RT1062 Teensy 4.1 i.MX ARM Cortex-M7 MPU Embedded Evaluation Board; CHECK_PRICES: https://www.snapeda.com/parts/DEV-16771/SparkFun+Electronics/view-part/?ref=eda; DESCRIPTION: RT1062 Teensy 4.1 series ARM® Cortex®-M7 MPU Embedded Evaluation Board; DIGIKEY_PART_NUMBER: 1568-DEV-16771-ND; MF: SparkFun Electronics; MP: DEV-16771; PACKAGE: None; PURCHASE-URL: https://www.snapeda.com/api/url_track_click_mouser/?unipart_id=4833875&manufacturer=SparkFun Electronics&part_name=DEV-16771&search_term=teensy 4.1; SNAPEDA_LINK: https://www.snapeda.com/parts/DEV-16771/SparkFun+Electronics/view-part/?ref=snap
U$1 U$10 U$13-U$17 U$24-U$36 = TSOP-6_MOS:TSOP-6_PMOS
U$2 = IIT_BOMBAY_Racing:LMC6464
U$3 = IIT_BOMBAY_Racing:LMC6462
U$7 U$8 = texas_1:SN65HVD230/1
U$9 = G6DN_Omron:G6DN_RELAY
U$20 = mylib:ZENER_DIODE
X1 = IIT_BOMBAY_Racing:HEADER_POS8_?: Molex - Micro-Fit 3.0 Series connector, 3.00mm (0.118") pitch header, 8 positions.
X2 = IIT_BOMBAY_Racing:HEADER_POS16_?: Molex - Micro-Fit 3.0 Series connector, 3.00mm (0.118") pitch header, 16 positions.
X3 = IIT_BOMBAY_Racing:HEADER_POS6_?: Molex - Micro-Fit 3.0 Series connector, 3.00mm (0.118") pitch header, 6 positions.
X4 = IIT_BOMBAY_Racing:HEADER_POS12_?: Molex - Micro-Fit 3.0 Series connector, 3.00mm (0.118") pitch header, 12 positions.

## Board
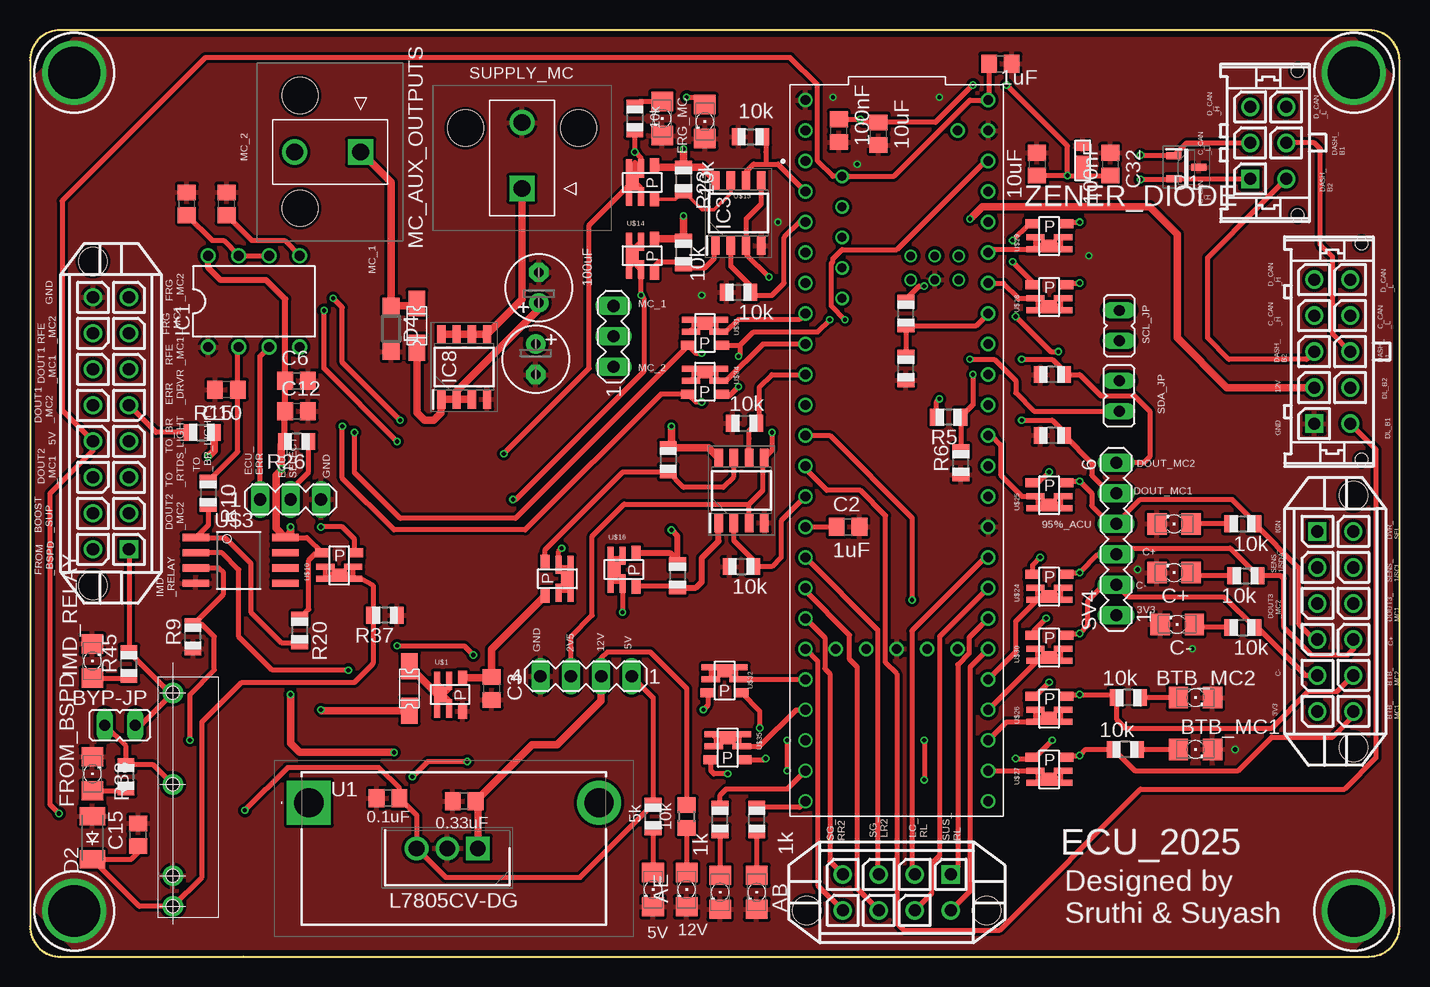
[diagram p3: board, top side]
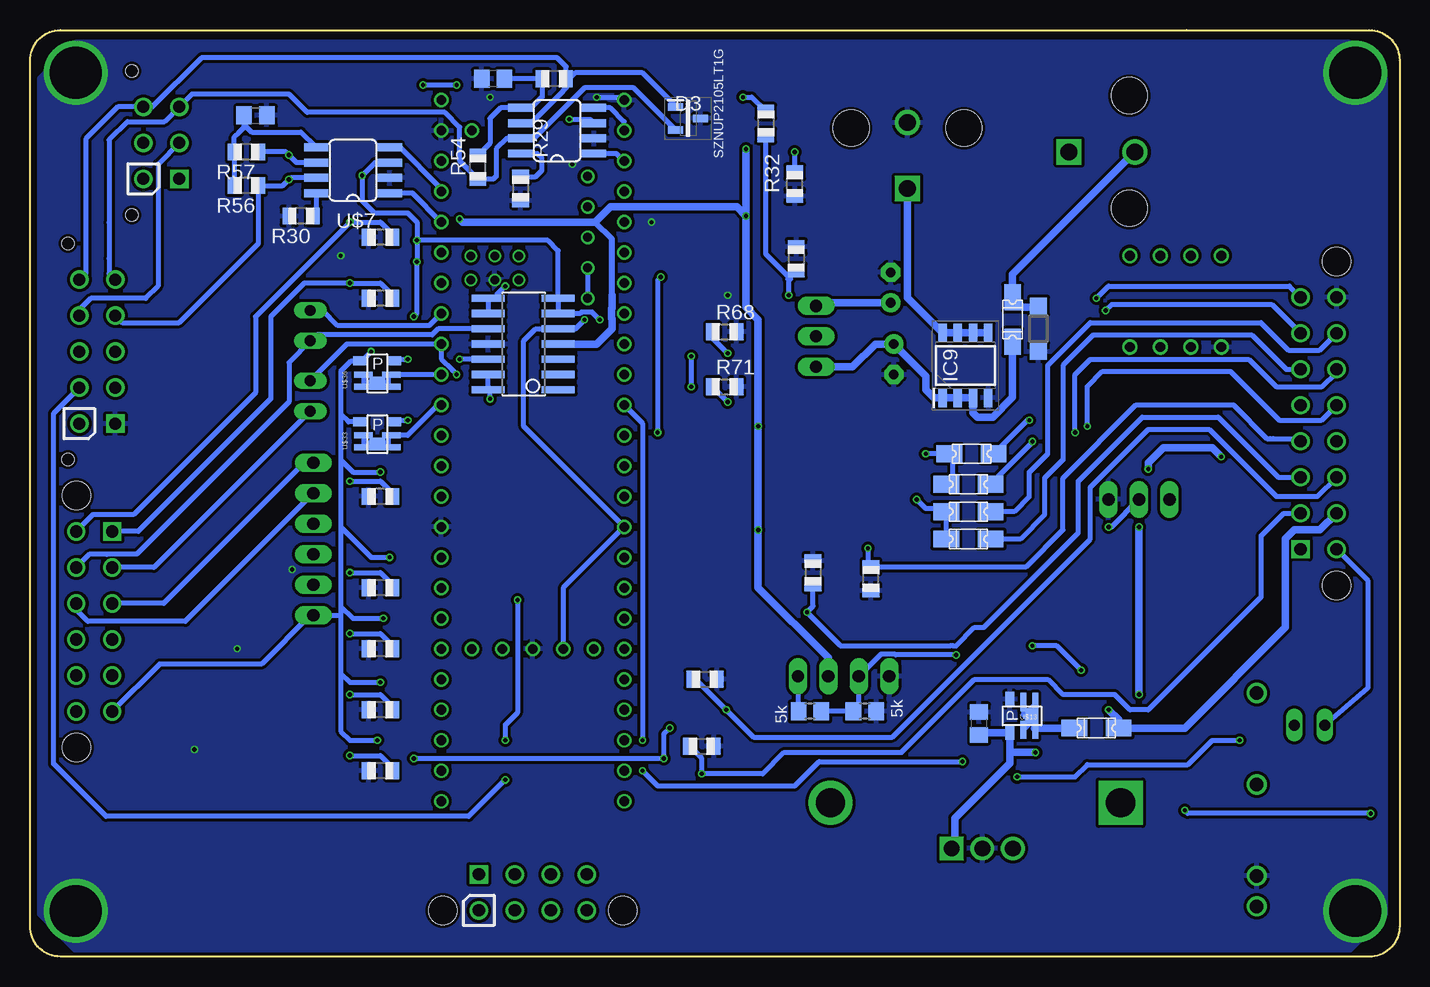
[diagram p4: board, bottom side, seen from below]

Size 114.17 x 77.23 mm. Coordinates in mm from the lower left corner, seen from the top.
Outline: 17.77,0 111.63,0.01 arc90 114.17,2.55 114.17,74.68 arc90 111.63,77.22 17.77,77.23 2.54,77.23 arc90 0,74.69 0,2.54 arc90 2.54,0 17.77,0
Copper layers (1*16): Top 0.035mm / dielectric 1.5mm / Bottom 0.035mm
Design rules "PCB_Power": minimum track width 5mil, minimum drill 10mil, track to track 5mil, track to pad 5mil, pad to pad 5mil, via to via 5mil, smd to smd 5mil, copper to edge 10mil, drill to drill 6mil, minimum pad ring 5mil, minimum via ring 5mil, stop-mask expansion 3mil, vias tented up to drill 0mil, thermal gap 10mil

### Footprints (pad centres in the part's own frame; a part is rotated, then mirrored left to right if it is on the bottom)
FKIT-LED-1206 = smd 1.6 x 1.803: A -1.422,0; C 1.422,0
172447-YY02 = drill 1.4 pad 1.9 square: 1 0,0 | drill 1.4 pad 1.9: 2 0,5.5 | hole 3: 4.7,5.04; -4.7,5.04
JP1 = drill 0.914 long: 1 0,-1.27; 2 0,1.27
C0805 = smd 1.3 x 1.5: 1 -0.95,0; 2 0.95,0
E2,5-6 = drill 0.813 pad 1.6: + -1.27,0 | drill 0.813 pad 1.6 octagon: - 1.27,0
SOT96P237X111-3N = smd 1.25 x 0.6: 1 -1.05,0.955; 2 -1.05,-0.955; 3 1.05,0
SOD-123_MINI-SMA = smd 1.5 x 2.1: A 1.8,0; C -1.8,0
SOD123 = smd 1.4 x 1.4: A 1.9,0; C -1.9,0
43045-1012 = drill 1.02 square: P$1 6,0 | drill 1.02: P$2 3,0; P$3 0,0; P$4 -3,0; P$5 -6,0; P$6 6,3; P$7 3,3; P$8 0,3; P$9 -3,3; P$10 -6,3 | hole 1.02: 9,3.94; -9,3.94
MA03-1 = drill 1.016 long: 1 -2.54,0; 2 0,0; 3 2.54,0
1206L = smd 2.16 x 1.4: P$1 -1.85,0; P$2 1.85,0
DIL08 = drill 0.813 pad 1.27: 1 -3.81,-3.81; 2 -1.27,-3.81; 3 1.27,-3.81; 4 3.81,-3.81; 5 3.81,3.81; 6 1.27,3.81; 7 -1.27,3.81; 8 -3.81,3.81
SOIC127P600X175-8N = smd 1.525 x 0.7: 1 -2.712,1.905; 2 -2.712,0.635; 3 -2.712,-0.635; 4 -2.712,-1.905; 5 2.712,-1.905; 6 2.712,-0.635; 7 2.712,0.635; 8 2.712,1.905
TO255P460X1020X2008-3P = drill 1.32 pad 1.98 square: 1 0,0 | drill 1.32 pad 1.98: 2 2.55,0; 3 5.1,0
R0805 = smd 1.3 x 1.5: 1 -0.95,0; 2 0.95,0
R0805' = smd 1.1 x 1.4: 1 -1,0; 2 1,0
MA04-1 = drill 1.016 long: 1 -3.81,0; 2 -1.27,0; 3 1.27,0; 4 3.81,0
MA06-1 = drill 1.016 long: 1 -6.35,0; 2 -3.81,0; 3 -1.27,0; 4 1.27,0; 5 3.81,0; 6 6.35,0
HSS10B20P40 = drill 2.45 pad 3.675 square: 1 0,0 | drill 2.45 pad 3.675: 2 24.2,0
MODULE_DEV-16771 = drill 0.8: 0 -26.67,-7.62; 1 -24.13,-7.62; 2 -21.59,-7.62; 3 -19.05,-7.62; 3.3V_1 6.35,-7.62; 3.3V_2 -24.13,7.62; 3.3V_3 16.51,-2.54; 4 -16.51,-7.62; 5 -13.97,-7.62; 6 -11.43,-7.62; 7 -8.89,-7.62; 8 -6.35,-7.62; 9 -3.81,-7.62; 10 -1.27,-7.62; 11 1.27,-7.62; 12 3.81,-7.62; 13 3.81,7.62; 14 1.27,7.62; 15 -1.27,7.62; 16 -3.81,7.62; 17 -6.35,7.62; 18 -8.89,7.62; 19 -11.43,7.62; 20 -13.97,7.62; 21 -16.51,7.62; 22 -19.05,7.62; 23 -21.59,7.62; 24 8.89,-7.62; 25 11.43,-7.62; 26 13.97,-7.62; 27 16.51,-7.62; 28 19.05,-7.62; 29 21.59,-7.62; 30 24.13,-7.62; 31 26.67,-7.62; 32 29.21,-7.62; 33 29.21,7.62; 34 26.67,7.62; 35 24.13,7.62; 36 21.59,7.62; 37 19.05,7.62; 38 16.51,7.62; 39 13.97,7.62; 40 11.43,7.62; 41 8.89,7.62; GND1 -29.21,-7.62; GND2 6.35,7.62; GND3 -26.67,7.62; GND4 16.51,0; ON/OFF 16.51,5.08; PROGRAM 16.51,2.54; VBAT 16.51,-5.08; VIN -29.21,7.62; VUSB -26.67,5.08 | drill 0.75: 5V -22.86,-4.57; D+ -17.78,-4.57; D- -20.32,-4.57; USB_GND1 -15.24,-4.57; USB_GND2 -12.7,-4.57 | drill 0.7: GND5 -14.24,3.17; LED -16.24,3.17; R+ -16.24,5.17; R- -14.24,5.17; T+ -14.24,1.17; T- -16.24,1.17
TSOP-6_PMOS = smd 0.5 x 1.92: 1 -1,-0.96; 6 -1,0.96 | smd 0.5 x 1.52: 2 0,-1.16; 5 0,1.16 | smd 0.635 x 1.27: D -0.5,0 | smd 0.75 x 1.2: G 1.13,-1.4; S 1.13,1.4
SO14_LONGPADS = smd 0.61 x 2.762: 1 -6.35,-1.61; 2 -5.08,-1.61; 3 -3.81,-1.61; 4 -2.54,-1.61; 5 -1.27,-1.61; 6 0,-1.61; 7 1.27,-1.61; 8 1.27,4.226; 9 0,4.226; 10 -1.27,4.226; 11 -2.54,4.226; 12 -3.81,4.226; 13 -5.08,4.226; 14 -6.35,4.226
S08 = smd 0.61 x 2.21: 1 -1.905,-3.569; 2 -0.635,-3.569; 3 0.635,-3.569; 4 1.905,-3.569; 5 1.905,3.886; 6 0.635,3.886; 7 -0.635,3.886; 8 -1.905,3.886
SO8 = smd 0.66 x 2.032: 1 -1.905,-3.073; 2 -0.635,-3.073; 3 0.635,-3.073; 4 1.905,-3.073; 5 1.905,3.073; 6 0.635,3.073; 7 -0.635,3.073; 8 -1.905,3.073
G6DN_RELAY = drill 1.118 pad 1.575: P$1 0.889,3.708; P$2 3.429,3.708; P$3 11.049,3.708; P$4 18.669,3.708
SOD323HE = smd 1.092 x 0.787: ANODE- 0,0 | smd 1.092 x 2.007: CATHODE+ 0,-1.829
44769-0801 = drill 1.02 square: P$1 -4.5,0 | drill 1.02: P$2 -1.5,0; P$3 1.5,0; P$4 4.5,0; P$5 -4.5,3; P$6 -1.5,3; P$7 1.5,3; P$8 4.5,3 | hole 2.36: 7.5,3; -7.5,3
44769-1601 = drill 1.02 square: P$1 -10.5,0 | drill 1.02: P$2 -7.5,0; P$3 -4.5,0; P$4 -1.5,0; P$5 1.5,0; P$6 4.5,0; P$7 7.5,0; P$8 10.5,0; P$9 -10.5,3; P$10 -7.5,3; P$11 -4.5,3; P$12 -1.5,3; P$13 1.5,3; P$14 4.5,3; P$15 7.5,3; P$16 10.5,3 | hole 2.36: 13.5,3; -13.5,3
43045-0612 = drill 1.02 square: P$1 3,0 | drill 1.02: P$2 0,0; P$3 -3,0; P$4 3,3; P$5 0,3; P$6 -3,3 | hole 1.02: 6,3.94; -6,3.94
44769-1201 = drill 1.02 square: P$1 -7.5,0 | drill 1.02: P$2 -4.5,0; P$3 -1.5,0; P$4 1.5,0; P$5 4.5,0; P$6 7.5,0; P$7 -7.5,3; P$8 -4.5,3; P$9 -1.5,3; P$10 1.5,3; P$11 4.5,3; P$12 7.5,3 | hole 2.36: 10.5,3; -10.5,3

### Placement (x,y rotation side)
5V  51.94,5.59 270 top
12V  54.74,5.59 270 top
>95%ACU  95.38,36.07 180 top
AB  60.58,5.37 270 top
AE  57.53,5.37 270 top
BOOSTED_SUPPLY1  41.02,64.01 0 top
BTB_MC1  97.16,17.28 0 top
BTB_MC2  97.16,21.6 0 top
BYP-JP  7.49,19.31 90 top
C1  80.9,74.43 0 top
C2  68.2,35.82 0 top
C3  38.48,22.36 270 top
C4  35.05,19.44 90 bottom
C5  83.95,66.05 270 top
C6  22.22,48.01 0 top
C7  42.42,55.76 90 top
C8  42.16,49.79 270 top
C10  16.38,47.25 180 top
C11  16.38,62.74 90 top
C12  22.22,45.47 0 top
C13  13.08,62.74 90 top
C15  9.02,10.17 90 top
C32  90.04,66.05 270 top
C34  67.44,68.84 90 top
C35  70.74,68.59 90 top
C36  95.38,70.11 0 bottom
C37  75.56,73.16 180 bottom
C+  95.38,32.01 180 top
C-  95.63,27.69 180 top
D1  96.39,65.79 0 top
D2  5.21,9.91 90 top
D3  59.31,69.86 0 bottom
D4  30.1,52.33 270 top
D5  30.1,52.33 270 bottom
DATA_LOGGER  107.06,50.43 270 top
ECU_JPR  21.72,38.11 0 top
F1  25.27,19.06 180 bottom
F2  32.26,53.09 270 bottom
F3  32.26,52.58 270 top
F4  35.69,41.92 0 bottom
F5  35.94,34.8 0 bottom
F6  35.94,39.38 0 bottom
F7  35.94,37.09 0 bottom
F8  31.62,22.36 90 top
FRG_MC  52.7,69.86 270 top
FROM_BSPD  5.21,15.25 90 top
IC1  18.67,54.62 0 top
IC2  59.31,38.87 90 top
IC3  59.05,61.98 90 top
IC4  37.34,9.02 180 top
IC8  36.2,49.16 90 top
IC9  36.2,49.28 90 bottom
IMD_RELAY  5.21,24.64 90 top
IN_CAP  36.2,12.96 180 top
JP1  90.81,46.74 180 top
JP2  90.81,52.58 0 top
MC_AUX_OUTPUTS  27.56,67.06 90 top
OUT_CAP  29.84,13.21 180 top
R1  54.74,11.69 270 top
R2  5k  [R0805']  51.94,11.69 90 top
R3  5K  [R0805']  73.03,53.6 90 top
R4  10K  [R0805']  73.03,49.03 90 top
R5  5K  [R0805']  76.58,44.96 180 top
R6  10K  [R0805']  77.6,41.15 90 top
R7  10k  [R0805']  59.31,32.52 0 top
R8  10k  [R0805']  59.56,44.46 0 top
R9  10k  [R0805']  13.59,26.68 90 top
R10  200k  [R0805']  14.86,38.61 270 top
R11  10k  [R0805']  101.35,31.76 0 top
R12  10k  [R0805']  101.09,36.07 0 top
R13  10k  [R0805']  101.09,27.44 0 top
R14  10k  [R0805']  52.83,69.44 270 bottom
R15  10k  [R0805']  14.35,43.69 0 top
R16  10k  [R0805']  50.42,69.86 270 top
R17  44.58,20.45 180 bottom
R19  10k  [R0805']  53.21,41.41 270 top
R20  1k  [R0805']  22.48,27.18 270 top
R21  49.15,20.45 180 bottom
R22  10k  [R0805']  53.98,31.76 270 top
R23  10k  [R0805']  54.48,64.78 270 top
R24  10k  [R0805']  54.48,58.68 270 top
R25  1k  [R0805']  60.58,11.44 90 top
R26  10k  [R0805']  22.22,42.93 180 top
R27  10k  [R0805']  91.31,17.28 180 top
R28  10k  [R0805']  91.57,21.6 180 top
R29  4k7  [R0805']  73.28,64.01 270 bottom
R30  4k7  [R0805']  91.57,61.73 180 bottom
R31  10k  [R0805']  50.29,58.17 270 bottom
R32  10k  [R0805']  50.42,64.4 90 bottom
R33  1k  [R0805']  57.53,11.44 90 top
R34  10k  [R0805']  59.05,55.38 0 top
R36  10k  [R0805']  60.07,68.33 0 top
R37  100k  [R0805']  29.59,28.45 180 top
R38  10k  [R0805']  8,14.99 90 top
R45  10k  [R0805']  8.25,24.39 90 top
R52  10k  [R0805']  48.9,32.01 270 bottom
R53  10k  [R0805']  44.07,31.5 90 bottom
R54  60E  [R0805']  76.84,65.79 90 bottom
R55  60E  [R0805']  70.48,73.16 180 bottom
R56  60E  [R0805']  96.14,64.27 180 bottom
R57  60E  [R0805']  96.14,67.06 180 bottom
R61  100k  [R0805']  84.96,15.5 180 bottom
R62  100k  [R0805']  84.96,20.58 180 bottom
R63  100k  [R0805']  84.96,30.74 180 bottom
R64  100k  [R0805']  84.96,59.95 180 bottom
R65  100k  [R0805']  84.96,54.87 180 bottom
R66  100k  [R0805']  84.96,38.36 180 bottom
R67  100k  [R0805']  84.96,25.66 180 bottom
R68  100k  [R0805']  56.26,52.08 0 bottom
R69  100k  [R0805']  57.91,23.12 0 bottom
R70  100k  [R0805']  85.22,43.44 180 top
R71  100k  [R0805']  56.26,47.5 0 bottom
R72  100k  [R0805']  58.17,17.53 0 bottom
R73  100k  [R0805']  85.22,48.52 180 top
RFE_MC  56.26,69.6 270 top
SV2  46.35,23.37 180 top
SV3  48.64,51.7 90 top
SV4  90.55,34.8 90 top
U1  23.24,12.83 0 top
U2  72.26,42.17 270 top
U$1  34.92,21.85 0 top
U$2  71.75,53.6 90 bottom
U$3  17.4,33.03 270 top
U$7  87.25,65.54 90 bottom
U$8  70.23,68.84 90 bottom
U$9  15.62,3.31 90 top
U$10  25.78,32.52 90 top
U$13  31.37,20.07 180 bottom
U$14  50.93,58.43 0 top
U$15  50.93,64.52 0 top
U$16  49.4,32.26 0 top
U$17  44.07,31.5 180 top
U$20  87.76,67.57 0 top
U$24  84.96,30.74 90 top
U$25  84.96,38.36 90 top
U$26  84.96,20.58 90 top
U$27  84.96,15.5 90 top
U$28  84.96,54.87 90 top
U$29  84.96,59.95 90 top
U$30  84.96,25.66 90 top
U$31  56.26,52.08 270 top
U$32  57.91,23.12 270 top
U$33  85.22,43.44 90 bottom
U$34  56.26,48.01 270 top
U$35  58.17,17.53 270 top
U$36  85.22,48.52 90 bottom
X1  72.26,6.86 180 top
X2  8.25,44.46 90 top
X3  101.73,67.82 270 top
X4  107.31,27.95 270 top

### Tracks (layer width: path | path; a pad name or v marks a point on that pad's centre or on a via)
2V5  (via drill 0.35)
  Top 0.406: IC3.5 60.96,62.74 59.69,61.47 IC3.3 59.69,58.55 v61.59,56.65 | IC2.3 59.94,37.73 | 59.94,37.73 61.09,38.87 61.09,41.45 IC2.5 61.85,42.22 v61.85,43.69 | SV2.3 45.09,26.68 46.86,28.45 46.86,35.06 49.53,37.73 59.94,37.73 | v30.61,25.91 36.2,25.91 v36.96,25.15 | v26.54,23.88 20.19,23.88 17.4,26.68 17.4,32.26 16,33.66 U$3.2
  Bottom 0.406: v61.59,56.65 61.85,56.39 v61.85,43.69 | R21.1 R17.2 45.09,20.9 SV2.3 43.23,25.23 42.09,25.23 42.02,25.15 v36.96,25.15 | v26.54,23.88 28.57,25.91 v30.61,25.91
3V3  (via drill 0.35)
  Top 0.406: v81.91,59.7 83.3,61.08 U$29.S | v81.91,57.92 83.56,56.27 U$28.S | U$30.S 83.69,26.92 83.69,27.18 v84.71,28.2 | U$34.S 57.8,46.74 58.29,46.74 v59.05,47.5 | C34.2 v69.22,69.79 69.47,69.54 C35.2 75.5,69.54 v78.61,72.65 | v86.49,65.1 C5.2 | v86.49,65.1 87.69,65.1 87.76,65.03 U$20.CATHODE+ 88.4,65.1 C32.2 | v84.96,40.39 84.06,39.49 U$25.S | v84.2,33.28 83.56,32.64 U$24.S | v84.96,22.87 83.81,21.71 U$26.S | v85.22,18.04 83.81,16.63 U$27.S 83.45,16.52 v82.17,16.52 | U$31.S 59.2,50.95 | v66.67,53.09 65.66,52.08 60.32,52.08 59.2,50.95 | 59.2,50.95 59.2,50.18 v59.05,50.04 | v86.49,65.1 86.49,67.57 v81.41,72.65 | U$35.S 61.23,16.4 v61.34,16.52 | v60.83,19.06 60.83,20.47 U$32.S | v82.17,53.35 85.09,50.43 v85.72,50.43
  Bottom 0.406: v81.91,59.7 v81.91,57.92 81.91,53.6 v82.17,53.35 | v81.91,59.7 70.99,59.7 70.15,58.85 U$2.7 U$2.6 68.33,53.6 68.21,53.72 67.31,53.72 v66.67,53.09 | v69.22,69.79 67.47,69.79 U$8.3 | U$7.3 85.41,66.17 v86.49,65.1 86.49,63 85.47,61.98 82.68,61.98 81.91,61.22 v81.91,59.7 | 88.27,45.22 88.27,48.77 87.39,49.65 U$36.S 86.5,49.65 v85.72,50.43 | 88.27,45.22 87.62,44.57 U$33.S | 88.27,45.22 88.27,41.41 | v84.96,40.39 87.25,40.39 88.27,41.41 | 88.27,41.41 88.27,35.82 | v84.2,33.28 85.72,33.28 88.27,35.82 | v84.71,28.2 87.25,28.2 88.27,29.22 | 88.27,29.22 88.27,28.45 | 88.27,28.45 88.27,23.63 | v84.96,22.87 87.5,22.87 88.27,23.63 | 88.27,23.63 88.27,18.8 87.5,18.04 v85.22,18.04 | v59.05,50.04 v59.05,47.5 | 88.27,35.82 88.27,29.22 | v82.17,16.52 v61.34,16.52 61.34,18.55 v60.83,19.06 | 88.27,28.45 SV4.1 90.81,28.45 94.87,24.39 103.37,24.39 X4.P$6 | v81.41,72.65 v78.61,72.65
3V3_TEENSY  (via drill 0.35)
  Top 0.406: U2.3.3V_1 C2.1 | v67.94,53.09 66.8,54.24 66.8,57.78 66.93,57.91 66.93,58.17 67.69,58.93 72.26,58.93 79.63,66.3 U2.3.3V_2
  Bottom 0.406: v67.94,53.09 68.71,52.33 U$2.5 72.01,52.33 73.03,51.31 73.03,44.2 U2.3.3V_1 69.72,30.74 U2.3.3V_3
5V  (via drill 0.35)
  Top 0.406: C1.1 79.95,71.45 U2.VIN 78.36,71.38 72.01,65.03 U2.5V 66.93,65.03 65.66,66.3 65.66,72.65 63.37,74.94 14.6,74.94 2.67,63 2.67,45.54 X2.P$12 5.25,42.19 1.65,38.59 1.65,12.71 v2.41,11.94 | SV2.1 51.94,21.6 R2.2 45.86,6.61 34.65,6.61 IC4.3 32.24,11.77 OUT_CAP.1 30.79,14.04 29.08,15.75 21.46,15.75 v17.91,12.2
  Bottom 0.406: R21.2 50.1,23.31 SV2.1 | v2.41,11.94 17.65,11.94 v17.91,12.2
12V  (via drill 0.35)
  Top 0.406: SV2.2 47.62,24.9 48.13,25.41 51.69,25.41 54.74,22.36 R1.1 | R20.1 23.24,28.95 23.24,33.03 23.86,33.65 U$10.S 23.1,34.93 U$3.8
  Top 0.508: R22.1 53.98,33.03 | 53.98,33.03 53.98,35.06 v53.47,35.57 | U$16.S 53.34,33.66 53.98,33.03 | R26.2 21.22,45.42 C12.1 C6.1 21.27,54.8 19.68,56.39 15.88,56.39 14.86,57.41 IC1.8
  Top 0.61: U$14.S 54.34,59.83 | 54.34,59.83 R24.1 | U$15.S 52.2,65.78 R23.1 | R23.1 56.07,65.78 IC3.8 | R19.1 53.47,42.41 | 53.47,42.41 56.58,42.41 IC2.8 | R23.1 v54.48,67.32 | v54.48,61.73 54.48,59.97 54.34,59.83 | v53.47,44.2 53.47,42.41 | v78.36,61.47 79.38,62.49 93.34,62.49 95.63,60.2 95.63,51.57 99.77,47.43 DATA_LOGGER.P$2 | SV2.2 47.62,21.34 43.94,17.66 41.84,17.66 IN_CAP.1 37.34,12.77 IC4.1 | R15.2 15.35,42.15 v14.86,41.66 | R26.2 20.95,42.66 v20.95,40.65 20.95,40.56 20.52,40.12 20.52,35.69 U$3.8 21.72,35.36 v21.72,35.82 | v21.72,21.85 21.72,17.79 22.48,17.02 v30.35,17.02
  Bottom 0.508: 65.66,55.12 65.66,59.83 67.05,61.22
  Bottom 0.61: v54.48,67.32 v54.48,61.73 | v54.48,61.73 54.48,54.11 53.47,53.09 v53.47,44.2 v53.47,35.57 53.47,30.74 47.62,24.9 SV2.2 | v54.48,61.73 55.24,62.49 65.78,62.49 67.05,61.22 78.1,61.22 v78.36,61.47 | IC4.1 37.08,9.28 37.08,11.55 32.5,16.13 32.5,17.02 | 32.5,17.02 U$13.S 34.87,18.67 C4.1 | v14.86,41.66 15.62,42.42 19.68,42.42 20.95,41.15 v20.95,40.65 | v21.72,35.82 v21.72,21.85 | v30.35,17.02 32.5,17.02 | 65.66,55.12 65.66,54.04 65.67,54.03 65.67,53.17 65.66,53.16 65.66,52.33 66.93,51.06 U$2.4
>95%_ACU  (via drill 0.35)
  Top 0.406: U$25.G 86.5,39.63 v87.5,39.63 88.52,38.61 88.52,37.6 90.04,36.07 SV4.4 92.58,38.11 100.2,38.11 102.09,36.22 R12.2 105.79,32.38 105.79,27.69 107.04,26.45 X4.P$4
  Bottom 0.406: v87.5,39.63 84.96,39.63 83.96,38.63 R66.1
>95%_FINAL_3V3_INV
  Top 0.406: U$25.2 85.92,38.16 U$25.1 85.42,37.86 U$25.D 84.5,37.86 U$25.6 84,38.16 U$25.5 82.71,38.36 80.9,40.17 80.9,42.68 80.14,43.44 U2.15
AB
  Top 0.406: R25.2 60.58,12.45 64.13,12.45 U2.32
AE
  Top 0.406: R33.2 57.53,13.47 58.04,13.98 63.12,13.98 U2.31
AUXILIARY_VOLTAGE_MC1
  Top 0.61: F3.P$1 32.26,54.23 D4.C 30.1,64.52 MC_AUX_OUTPUTS.1
AUXILIARY_VOLTAGE_MC2
  Bottom 0.61: D5.C 30.22,54.11 31.42,54.11 F2.P$1 32.26,56.86 MC_AUX_OUTPUTS.2
BOOSTED_SUPPLY  (via drill 0.35)
  Top 0.61: v24.26,20.58 24.33,20.51 F8.P$1
  Bottom 0.61: v24.26,20.58 23.42,19.75 F1.P$1 17.91,19.06 9.52,27.44 9.52,34.83 8.79,35.57 6.64,35.57 X2.P$10
BR_LIGHT_SIG
  Top 0.406: IC2.6 59.94,43.19 59.94,43.84 R8.2 60.83,44.73 60.83,47.5 61.85,48.52 U2.8
BR_LIGHT_SUPPLY
  Top 0.61: U$1.S 38.42,23.25 C3.1 38.48,25.64 U$17.S
BTB_FROM_MC1  (via drill 0.35)
  Top 0.406: U$27.G 86.5,16.77 v87.5,16.77 88.01,17.28 R27.2 92.09,15.5 100.71,15.5 103.5,18.29 108.59,18.29 110.31,20.02 X4.P$12
  Bottom 0.406: v87.5,16.77 84.96,16.77 83.96,15.77 R61.1
BTB_FROM_MC1_3V3_INV
  Top 0.406: U2.34 U$27.5 84,15.3 U$27.6 84.5,15 U$27.D 85.42,15 U$27.1 85.92,15.3 U$27.2
BTB_FROM_MC2  (via drill 0.35)
  Top 0.406: U$26.G 86.5,21.85 v87.5,21.85 90.31,21.85 R28.2 90.57,19.8 91.31,19.06 103.5,19.06 106.55,22.1 108.97,22.1 X4.P$11
  Bottom 0.406: v87.5,21.85 84.96,21.85 83.96,20.85 R62.1
BTB_FROM_MC2_3V3_INV
  Top 0.406: U2.35 81.42,19.58 U$26.6 | U$26.5 83.8,19.78 U$26.6 | U$26.6 84.5,20.08 U$26.D 85.46,19.58 U$26.1 85.92,20.38 U$26.2
C+  (via drill 0.35)
  Top 0.406: U$24.G 86.5,32.01 v87.5,32.01 89.03,33.53 SV4.3 91.06,34.04 100.06,34.04 R11.2 104.27,31.76 104.52,31.5 104.52,27.44 106.81,25.15 109.86,25.15 110.31,25.61 X4.P$10
  Bottom 0.406: v87.5,32.01 84.96,32.01 83.96,31.01 R63.1
C+_3V3_INV
  Top 0.406: 83.96,29.74 U$24.6 84.5,30.24 U$24.D 85.42,30.24 U$24.1 85.92,30.54 U$24.2 | U$24.5 83.96,30.58 83.96,29.74 | 83.96,29.74 82.17,27.95 82.17,25.41 U2.37
C-  (via drill 0.35)
  Top 0.406: U$30.G 86.5,26.93 v87.5,26.93 88.19,27.62 88.19,29.67 89.51,30.99 SV4.2 91.57,29.98 99.55,29.98 R13.2 102.31,27.44 106.3,23.45 X4.P$5
  Bottom 0.406: v87.5,26.93 84.96,26.93 83.96,25.93 R67.1
C-_3V3_INV
  Top 0.406: U2.36 83.96,24.66 | 83.96,24.66 U$30.6 84.5,25.16 U$30.D 85.42,25.16 U$30.1 85.92,25.46 U$30.2 | U$30.5 83.96,25.5 83.96,24.66
C_CAN_H  (via drill 0.35)
  Top 0.406: v92.58,64.78 95.28,64.78 D1.2 101.71,64.84 X3.P$1
  Bottom 0.406: U$7.7 92.46,64.9 v92.58,64.78 93.09,64.27 R56.1 95.14,59.43 101.73,52.84 106.47,52.84 DATA_LOGGER.P$4
C_CAN_L  (via drill 0.35)
  Top 0.406: v92.58,66.81 95.28,66.81 D1.1 96.42,67.82 X3.P$2
  Bottom 0.406: U$7.6 91.95,66.17 v92.58,66.81 92.84,67.06 R57.1 | X3.P$2 103.5,66.05 103.5,55.89 104.52,54.87 109.09,54.87 110.06,53.9 DATA_LOGGER.P$9
C_RX
  Bottom 0.406: U2.23 79.88,64.01 83.44,67.57 84.05,67.57 U$7.4
C_TX
  Bottom 0.406: U2.22 82.3,63.63 U$7.1
D_CAN_H
  Bottom 0.406: D3.2 63.85,72.4 67.94,72.4 72.14,68.21 U$8.7 74.42,68.21 75.31,67.32 75.31,65.03 75.55,64.79 R54.1 78.36,66.32 78.36,69.14 79.58,70.36 91.06,70.36 92.58,71.89 100.66,71.89 X3.P$3 102.95,69.6 106.05,69.6 107.57,68.08 107.57,61.17 107.57,58.17 107.57,56.93 DATA_LOGGER.P$5
D_CAN_L
  Bottom 0.406: 69.48,72.9 R55.1 69.48,74.17 70.25,74.94 99.85,74.94 103.97,70.82 X3.P$6 106.86,70.82 109.53,68.15 109.53,56.96 DATA_LOGGER.P$10 | 69.48,72.9 69.48,72.4 69.72,72.16 69.72,72.14 72.39,69.48 U$8.6 | D3.1 60.36,70.91 63.12,73.67 68.72,73.67 69.48,72.9
D_RX
  Bottom 0.406: U$8.4 65.79,70.75 64.64,69.6 U2.0
D_TX
  Bottom 0.406: U$8.1 65.28,66.94 U2.1
DASH_B1
  Top 0.406: X3.P$5 107.06,67.82 107.57,67.32 107.57,59.31 108.59,58.29 108.59,51.9 DATA_LOGGER.P$8
DASH_B2
  Top 0.406: X3.P$4 102.49,62.59 98.17,58.27 98.17,51.57 99.95,49.79 106.43,49.79 DATA_LOGGER.P$3
DL_B1
  Top 0.406: U2.11 64.64,40.65 66.42,38.87 69.22,38.87 71.33,36.75 71.33,24.51 72.26,23.58 72.26,2.8 72.84,2.23 80.83,2.23 92.58,13.98 109.6,13.98 112.21,16.58 112.21,42.28 DATA_LOGGER.P$6
DL_B2  (via drill 0.35)
  Top 0.406: U2.10 66.67,43.44 73.53,36.58 v73.53,29.72 | v74.55,18.04 v74.55,14.74
  Bottom 0.406: v73.53,29.72 73.53,20.33 74.55,19.31 v74.55,18.04 | v74.55,14.74 77.6,11.69 107.82,11.69 112.21,16.07 112.21,45.28 DATA_LOGGER.P$7
DOUT1_MC1  (via drill 0.35)
  Top 0.406: v56.01,50.3 55.51,50.3 U$31.G 54.86,50.93 40.46,36.53 30.86,36.53 27.05,40.34 v27.05,43.69
  Bottom 0.406: v56.01,50.3 57.26,51.55 R68.1 | v27.05,43.69 27.05,48.52 25.78,49.79 12.57,49.79 10.29,47.5 6.48,47.5 5.25,48.73 X2.P$14
DOUT1_MC1_3V3
  Top 0.406: U$31.2 54.99,52.08 55.3,52.39 U$31.1 55.8,52.58 U$31.D 56.72,52.58 U$31.6 57.22,52.28 U$31.5 58.04,52.08 59.05,53.09 64.13,53.09 U2.6
DOUT1_MC2  (via drill 0.35)
  Top 0.406: v56.01,46.23 55.51,46.23 U$34.G 52.59,46.88 41.27,35.57 30.35,35.57 26.04,39.88 v26.04,44.2
  Bottom 0.406: v56.01,46.23 57.26,47.49 R71.1 | v26.04,44.2 26.04,47.5 24.76,48.77 14.1,48.77 10.03,44.71 6.5,44.71 X2.P$13
DOUT1_MC2_3V3
  Top 0.406: U$34.2 55.3,48.21 U$34.1 55.8,48.51 U$34.D 56.72,48.51 U$34.6 57.22,48.21 U$34.5 58.04,48.01 61.09,51.06 U2.7
DOUT2_MC1  (via drill 0.35)
  Top 0.406: U$32.G 56.51,20.96 v56.13,20.58
  Bottom 0.406: R69.1 58.67,23.12 v56.13,20.58 53.85,18.29 42.29,18.29 25.78,34.8 25.78,39.12 20.95,43.95 15.88,43.95 10.29,38.36 6.85,38.36 X2.P$11
DOUT2_MC1_3V3
  Top 0.406: U$32.2 56.75,23.92 U$32.1 57.41,24.12 U$32.D 58.37,23.62 U$32.6 58.87,23.32 U$32.5 U2.28
DOUT2_MC2  (via drill 0.35)
  Top 0.406: v58.17,15.25 57.02,15.25 56.77,15.5 U$35.G
  Bottom 0.406: R72.1 58.17,16.53 v58.17,15.25 53.09,15.25 51.31,17.03 41.53,17.03 35.43,23.12 29.34,23.12 28.07,21.85 23.75,21.85 22.48,20.58 20.95,20.58 11.56,29.98 11.56,35.06 9.66,36.96 X2.P$2
DOUT2_MC2_3V3
  Top 0.406: U$35.2 57.21,17.73 U$35.1 56.9,18.53 57.4,18.03 U$35.D 58.63,18.03 U$35.6 59.13,17.73 U$35.5 60.83,17.53 63.88,20.58 U2.29
DOUT3_MC1  (via drill 0.35)
  Top 0.406: v82.68,44.71 85.22,44.71 86.22,43.71 R70.1 88.52,41.14 88.52,40.14 90.04,38.61 SV4.5
  Bottom 0.406: U$33.G 83.68,44.71 v82.68,44.71 | SV4.5 101.22,27.95 109.35,27.95 110.31,28.91 X4.P$9
DOUT3_MC1_3V3
  Bottom 0.406: U$33.5 86.38,42.55 86.49,42.44 U$33.6 85.68,42.94 U$33.D 84.76,42.94 U$33.1 84.26,43.24 U$33.2 82.68,43.44 80.14,45.98 U2.16
DOUT3_MC2  (via drill 0.35)
  Top 0.406: v82.68,49.79 85.22,49.79 86.22,48.79 R73.1 87.5,48.52 89.28,46.74 92.08,46.74 93.34,45.47 93.34,41.66 92.84,41.15 SV4.6
  Bottom 0.406: U$36.G 83.68,49.79 v82.68,49.79 | X4.P$3 103.02,29.45 91.31,41.15 SV4.6
DOUT3_MC2_3V3
  Bottom 0.406: U$36.5 86.38,47.68 86.22,47.52 U$36.6 85.68,48.02 U$36.D 84.76,48.02 U$36.1 84.26,48.32 U$36.2 U2.17
DRIVER_SELECT  (via drill 0.35)
  Top 0.406: U$29.G 86.5,61.22 v87.5,61.22
  Bottom 0.406: R64.1 83.96,60.22 84.96,61.22 v87.5,61.22 95.38,53.35 95.38,47 105.54,36.84 108.93,36.84 X4.P$7
DRIVER_SELECT_3V3_INV
  Top 0.406: U2.21 80.15,58.95 U$29.6 | U$29.5 83.8,59.15 U$29.6 | U$29.6 84.5,59.45 U$29.D 85.42,59.45 U$29.1 85.92,59.75 U$29.2
ECU_ERR
  Top 0.406: ECU_JPR.1 19.18,50.04 IC1.3
ECU_MC_ERR_SIG  (via drill 0.35)
  Top 0.406: v63.12,18.04 v63.12,15.5 | v36.45,16.26 33.15,16.26 v31.88,14.99 | v13.33,18.04 13.33,21.85 15.37,23.88 15.37,26.68 14.37,27.68 R9.2 16.13,30.22 16.13,32.01 15.75,32.39 U$3.3
  Bottom 0.406: U2.9 63.12,44.46 v63.12,18.04 | v63.12,15.5 61.85,14.23 50.42,14.23 48.39,16.26 v36.45,16.26 | v31.88,14.99 27.05,14.99 26.04,16.01 17.65,16.01 15.62,18.04 v13.33,18.04
ECU_SELECT  (via drill 0.35)
  Top 0.406: U$10.G 27.05,33.78 27.05,34.8 26.04,35.82 v24.26,35.82 | ECU_JPR.2 21.72,38.87 23.22,40.38 R26.1
  Bottom 0.406: v24.26,35.82 24,35.82 ECU_JPR.2
ERR_RST_DRVR
  Top 0.406: R15.1 10.52,43.69 X2.P$5
FRG
  Top 0.406: IC3.6 59.69,65.41 60.32,66.05 61.34,66.05 | 61.34,66.05 62.36,66.05 U2.2 | R36.2 61.34,68.06 61.34,67.06 61.34,66.05
FRG_MC  (via drill 0.35)
  Top 0.406: 50.43,64.98 U$15.6 50.12,65.48 50.43,65.79 | U$15.1 49.93,64.02 50.17,64.26 | 50.17,64.26 U$15.D | U$15.2 50.93,64.02 U$15.D | U$15.D 50.43,64.98 | 50.43,65.18 50.43,65.54 | 50.43,65.54 50.43,65.79 | 50.43,65.79 50.43,66.18 U$15.5 | R16.2 50.43,68.85 50.42,68.84 v50.42,67.06 50.93,66.55 U$15.5 | U$15.5 50.57,65.68 50.43,65.54 | U$15.5 50.43,65.18 | 50.43,65.18 50.43,64.98 | v39.5,41.92 46.61,49.03 46.61,60.97 49.91,64.26 50.17,64.26
  Bottom 0.406: R32.2 v50.42,67.06 | F6.P$1 37.26,39.91 37.26,41.64 F4.P$1 v39.5,41.92
FRG_MC1  (via drill 0.35)
  Top 0.406: v30.61,42.93 24.51,49.03 v24.51,53.85
  Bottom 0.406: F6.P$2 30.61,42.86 v30.61,42.93 | v24.51,53.85 24,54.36 10.66,54.36 X2.P$7
FRG_MC2  (via drill 0.35)
  Top 0.406: v30.86,44.71 26.04,49.54 26.04,54.11 v25.27,54.87
  Bottom 0.406: F4.P$2 31.04,44.71 v30.86,44.71 | v25.27,54.87 24.26,55.89 9.18,55.89 X2.P$8
FROM_BSPD
  Top 0.406: U$9.P$3 10.28,15.99 R38.2 8,17.53 BYP-JP.2
  Bottom 0.406: BYP-JP.2 2.67,22.36 2.67,31.37 X2.P$9
GND  (via drill 0.35, 4.32 pad 0.95)
  Bottom 0.406: v66.93,71.63 64.9,71.63 U2.GND1
  other vias: 96.9,25.66 100.46,17.28 88.27,58.43 75.82,71.63 92.33,32.26 68.96,66.05 110.36,73.67 110.36,3.82 3.68,73.67 56.01,55.12 62.36,61.22 3.68,3.82
  pour Top (isolate 0.254): 3.68,76.46 110.36,76.46 113.41,73.41 113.41,3.82 110.36,0.77 3.68,0.77 0.63,3.82 0.63,73.41
  pour Bottom (isolate 0.254): 4.19,76.21 110.36,76.21 113.41,73.16 113.41,3.56 110.36,0.51 4.19,0.51 1.14,3.56 1.14,73.16
IGNITION_SWITCH  (via drill 0.35)
  Top 0.406: U$28.G 86.5,56.14 v87.5,56.14
  Bottom 0.406: R65.1 83.96,55.14 84.96,56.14 v87.5,56.14 91.31,56.14 94.11,53.35 94.11,46.49 105.15,35.45 X4.P$1
IGNITION_SWITCH_3V3_INV
  Top 0.406: U2.20 81.15,56.14 82.42,54.87 U$28.5 84,54.67 U$28.6 84.5,54.37 U$28.D 85.42,54.37 U$28.1 85.92,54.67 U$28.2
IMD_RELAY
  Top 0.406: X2.P$1 R45.2 11.67,21.98 U$9.P$4 9.25,19.31 BYP-JP.1
LC_RL
  Top 0.406: U2.41 79.63,33.28 73.51,27.16 73.51,7.12 X1.P$2
LC_RR
  Top 0.406: U2.40 75.82,26.68 75.82,8.43 75.16,7.77 75.16,5.26 X1.P$6
MC_1
  Top 0.61: IC8.2 IC8.1 34.29,45.35 33.65,44.71 32.89,44.71 32.26,45.35 F3.P$2 | C7.+ 42.42,53.98 35.56,47.12 IC8.2 | IC8.2 IC8.3
  Bottom 0.61: SV3.3 48.39,54.49 C7.+
MC_2
  Bottom 0.61: SV3.1 45.59,49.16 43.69,51.06 C8.+ 39.5,48.39 39.5,47.25 38.82,46.57 IC9.1 IC9.2 IC9.3 35.56,45.35 35.18,44.96 33.91,44.96 32.26,46.62 F2.P$2
N$1
  Top 0.406: R1.2 12V.A
N$2  (via drill 0.35)
  Top 0.406: v54.74,71.63 55.65,71.63 RFE_MC.A
  Bottom 0.406: R14.1 54.02,71.63 v54.74,71.63
N$3
  Top 0.406: R25.1 AB.A
N$4
  Top 0.406: R16.1 50.84,71.28 FRG_MC.A
N$5
  Top 0.406: R22.2 53.87,30.86 U$16.G
  Top 0.508: R22.2 55.51,30.76 56.01,31.25 56.01,33.24 57.4,34.63 IC2.1
N$6
  Top 0.406: R2.1 5V.A
N$7
  Top 0.406: IC2.7 58.67,40.01 57.79,39.12 54.5,39.12 R19.2 53.2,40.39 49.4,40.39 42.94,33.93 U$17.G
N$8
  Top 0.406: R33.1 AE.A
N$10
  Top 0.406: U$1.6 34.42,22.31 U$1.D | U$1.5 34.92,22.35 U$1.D | U$1.1 33.92,21.35 U$1.D | U$1.2 34.92,21.35 U$1.D
  Top 0.61: F8.P$2 33.98,21.85 U$1.D
N$12
  Top 0.406: IC1.2 17.33,50.74 C10.1 17.33,42.09 R10.1
N$13
  Top 0.406: C11.1 18.48,59.7 21.21,59.7 IC1.5
N$14
  Top 0.406: R10.2 14.86,35.96 U$3.1 16.26,34.93 18.41,32.77 18.41,28.71 20.94,26.18 R20.2
N$15
  Top 0.406: C+.A 97.05,31.76 R11.1
N$16
  Top 0.406: R12.1 >95%ACU.A
N$17
  Top 0.406: R13.1 97.31,27.44 C-.A
N$18
  Top 0.406: R27.1 BTB_MC1.A
N$19
  Top 0.406: C13.1 15.18,59.7 16.13,59.7 IC1.7 IC1.6
N$22
  Top 0.406: IMD_RELAY.A 8.09,23.22 R45.1
N$26
  Top 0.406: FROM_BSPD.A 7.83,13.82 R38.1
N$31
  Top 0.406: BTB_MC2.A R28.1
N$32
  Bottom 0.406: R29.1 72.03,65.01 71.5,65.54 71.5,66.55 71.88,66.94 U$8.8
N$33
  Bottom 0.406: R54.2 75.82,67.81 75.82,69.86 74.93,70.75 U$8.5 73.18,70.62 72.52,70.62 71.48,71.65 R55.2 C37.1
N$35
  Bottom 0.406: U$7.5 91.59,68.71 95.69,68.71 96.33,69.35 C36.1 96.38,69.07 96.75,68.72 97.14,68.33 R57.2 R56.2 | R56.2 97.14,63.78 97.16,63.76 97.16,64.25 R56.2
N$37
  Bottom 0.406: U$7.8 90.32,61.97 R30.1
N$46
  Bottom 0.406: U$13.6 30.37,19.57 30.74,19.94 | 30.74,19.94 U$13.D | U$13.1 30.74,20.66 30.74,19.94 | U$13.5 30.74,19.54 | 30.74,19.54 30.74,19.94 | U$13.2 31.37,20.17 30.74,19.54
  Bottom 0.61: U$13.6 30.42,19.06 F1.P$2
NET1  (via drill 0.35)
  Top 0.406: R3.2 73.03,54.79 74.12,55.89 v74.55,55.89
  Bottom 0.406: U$2.9 U$2.8 75.31,54.87 75.31,55.12 v74.55,55.89
NET2  (via drill 0.35)
  Top 0.406: R5.2 75.58,46.25 v75.82,46.49
  Bottom 0.406: U$2.14 75.98,47.5 | 75.98,47.5 U$2.13 | v75.82,46.49 75.82,47.34 75.98,47.5
RFE
  Top 0.406: IC3.2 58.42,57.92 58.42,57.54 60.05,55.9 R34.2 60.31,55.12 61.85,55.12 62.87,56.14 62.87,59.95 64.13,61.22 U2.3
RFE_MC  (via drill 0.35)
  Top 0.406: U$14.D 50.43,57.77 U$14.2 v50.93,55.12 51.18,54.87 51.18,48.77 40.51,38.11 v40.26,38.11 | U$14.1 50.43,57.97 U$14.D | U$14.6 50.43,58.89 U$14.D | U$14.D 50.43,59.09 U$14.5
  Bottom 0.406: R31.2 50.93,56.54 | 50.93,56.54 51,56.47 50.74,56.47 52.83,58.55 R14.2 | F5.P$1 F7.P$1 38.04,37.34 39.5,37.34 v40.26,38.11 | 50.93,56.54 v50.93,55.12
RFE_MC1
  Bottom 0.406: X2.P$6 9.45,48.96 12.32,51.82 25.53,51.82 28.07,49.28 28.07,41.41 29.59,39.88 29.59,36.84 31.62,34.8 F5.P$2
RFE_MC2
  Bottom 0.406: X2.P$15 6.66,50.55 9.27,50.55 11.56,52.84 25.78,52.84 29.34,49.28 29.34,41.92 30.86,40.39 30.86,38.36 32.13,37.09 F7.P$2
RTDS_SIG
  Top 0.406: IC2.2 58.67,34.68 60.31,33.04 R7.2 61.85,32.52 62.61,33.28 62.61,36.33 U2.12
SENS_1/SCL
  Bottom 0.406: U$2.10 80.14,52.33 80.65,51.82 90.3,51.82 JP2.1 92.58,49.54 92.58,46.23 105.28,33.54 107.77,33.54 107.78,33.53 109.23,33.53 X4.P$8
SENS_1/SCL_OUT
  Top 0.406: R4.2 R3.1 78.88,52.6 U2.19
  Bottom 0.406: U2.19 80.9,52.58 88.52,52.58 89.79,53.85 JP2.2
SENS_1/SDA  (via drill 0.35)
  Top 0.406: v78.36,49.79 80.39,49.79 82.17,48.01 82.17,47 83.69,45.47 JP1.2
  Bottom 0.406: U$2.12 v78.36,49.79 | JP1.2 103.83,32.45 X4.P$2
SENS_1/SDA_OUT  (via drill 0.35)
  Top 0.406: v78.61,48.52 78.61,46 R5.1 77.6,44.95 R6.2
  Bottom 0.406: JP1.1 87.76,51.06 U2.18 79.88,49.84 78.95,48.91 78.95,48.86 v78.61,48.52
SG_LR1
  Top 0.406: U2.25 64.64,30.49 68.33,26.8 68.33,24.77 68.96,24.14 68.96,5.67 X1.P$7
SG_LR2
  Top 0.406: X1.P$3 70.65,6.97 70.65,27.27 U2.24
SG_RR1
  Top 0.406: U2.27 65.66,24.64 65.66,5.97 X1.P$8
SG_RR2
  Top 0.406: U2.26 66.25,26.59 66.25,24.01 66.67,23.58 66.67,7.95 X1.P$4
SUPPLY_MC
  Top 0.61: IC8.8 IC8.7 IC8.6 IC8.5 41.02,54.79 BOOSTED_SUPPLY1.1
  Bottom 0.61: BOOSTED_SUPPLY1.1 41.02,54.92 IC9.8 IC9.7 IC9.6 IC9.5
SUS_RL
  Top 0.406: U2.39 78.27,26.59 78.27,25.28 77.34,24.34 77.34,7.44 X1.P$1
SUS_RR
  Top 0.406: U2.38 78.36,24.14 78.36,5.46 X1.P$5
TO_BR_LIGHT  (via drill 0.35)
  Top 0.406: U$17.5 44.27,30.54 U$17.6 44.57,31.04 U$17.D 45.07,32 U$17.1 44.27,32.46 U$17.2 44.07,33.79 v44.32,34.04
  Bottom 0.406: v44.32,34.04 44.32,32.76 R53.2 31.13,32.5 28.07,35.57 28.07,39.88 21.97,45.98 13.84,45.98 11.05,43.19 10.79,43.19 10.54,43.19 8.48,43.19 X2.P$4
TO_ECU_RELAY
  Top 0.406: U$10.1 27.61,31.52 28.59,30.94 R37.2 28.59,24.46 28.55,24.43 28.55,24.37 27.05,22.87 17.65,22.87 14.35,19.56 14.35,6.64 U$9.P$1 9.12,4.2 D2.C 8.42,8.11 9.02,8.71 C15.1 | U$10.5 24.62,31.72 U$10.6 25.32,32.02 U$10.D 26.24,32.02 U$10.1 | U$10.1 26.94,31.72 U$10.2
TO_FRG_ENABLE
  Top 0.305: IC3.7 58.42,63.63 57.02,62.24 56.02,62.24 R23.2 53.83,63.12 U$15.G
TO_RFE_ENABLE
  Top 0.406: IC3.1 57.04,59.17 57.04,58.19 56.26,57.41 54.75,57.41 R24.2 54.35,57.55 53.98,57.92 52.45,57.92 52.06,57.52 U$14.G
TO_RTDS  (via drill 0.35)
  Top 0.406: U$16.5 49.2,33.22 U$16.6 48.9,32.47 U$16.D 48.9,31.8 U$16.1 49.2,31.3 U$16.2 v49.4,28.71
  Bottom 0.406: R52.2 48.9,29.22 v49.4,28.71 46.61,25.91 37.46,25.91 37.21,25.91 36.96,25.91 35.43,27.44 34.67,27.44 26.8,35.31 26.8,39.63 21.46,44.96 15.11,44.96 10.1,39.96 X2.P$3
USB_GND
  Bottom 0.406: U2.USB_GND1 U2.USB_GND2

### Text on the board
tPlace: SUPPLY_MC | ECU_2025 | Designed by / Sruthi & Suyash
tNames: D_CAN / _H | D_CAN / _L | C_CAN / _L | DASH_ / B1 | MC_2 | DASH_ / B2 | C_CAN / _H | MC_1 | D_CAN / _H | FRG / _MC2 | D_CAN / _L | GND | MC_1 | C_CAN / _H | FRG / _MC1 | C_CAN / _L | RFE / _MC2 | SCL_JP | DASH_ / B2 | DASH_ / B1 | RFE / _MC1 | MC_2 | DOUT1 / _MC1 | 12V | DL_B2 | ERR / _DRVR | DOUT1 / _MC2 | SDA_JP | GND | 5V | DL_B1 | TO_BR / _LIGHT | DOUT_MC2 | TO / _BR_LIGHT | ECU_ / ERR | ECU_ / SELECT | GND | DOUT2 / _MC1 | TO / _RTDS | DOUT_MC1 | DOUT2 / _MC2 | 95%_ACU | BOOST / _SUP | IGN | DVR_ / SEL | C+ | FROM / _BSPD | SENS_ / 1/SDA | C- | SENS_ / 1/SCL | IMD / _RELAY | 3V3 | DOUT3 / _MC2 | DOUT3_ / MC1 | 5V | C+ | GND | 2V5 | 12V | C- | BTB_ / MC2 | 3V3 | BTB_ / MC1 | SG_ / RR2 | SG_ / LR2 | LC_ / RL | SUS_ / RL